# EAGLE design BLDC Controller (EAGLE 6.5.0)
AUTHOR: Douglas Hutchings; REVISION: A; YEAR: 2014

## Sheet 1 of 5
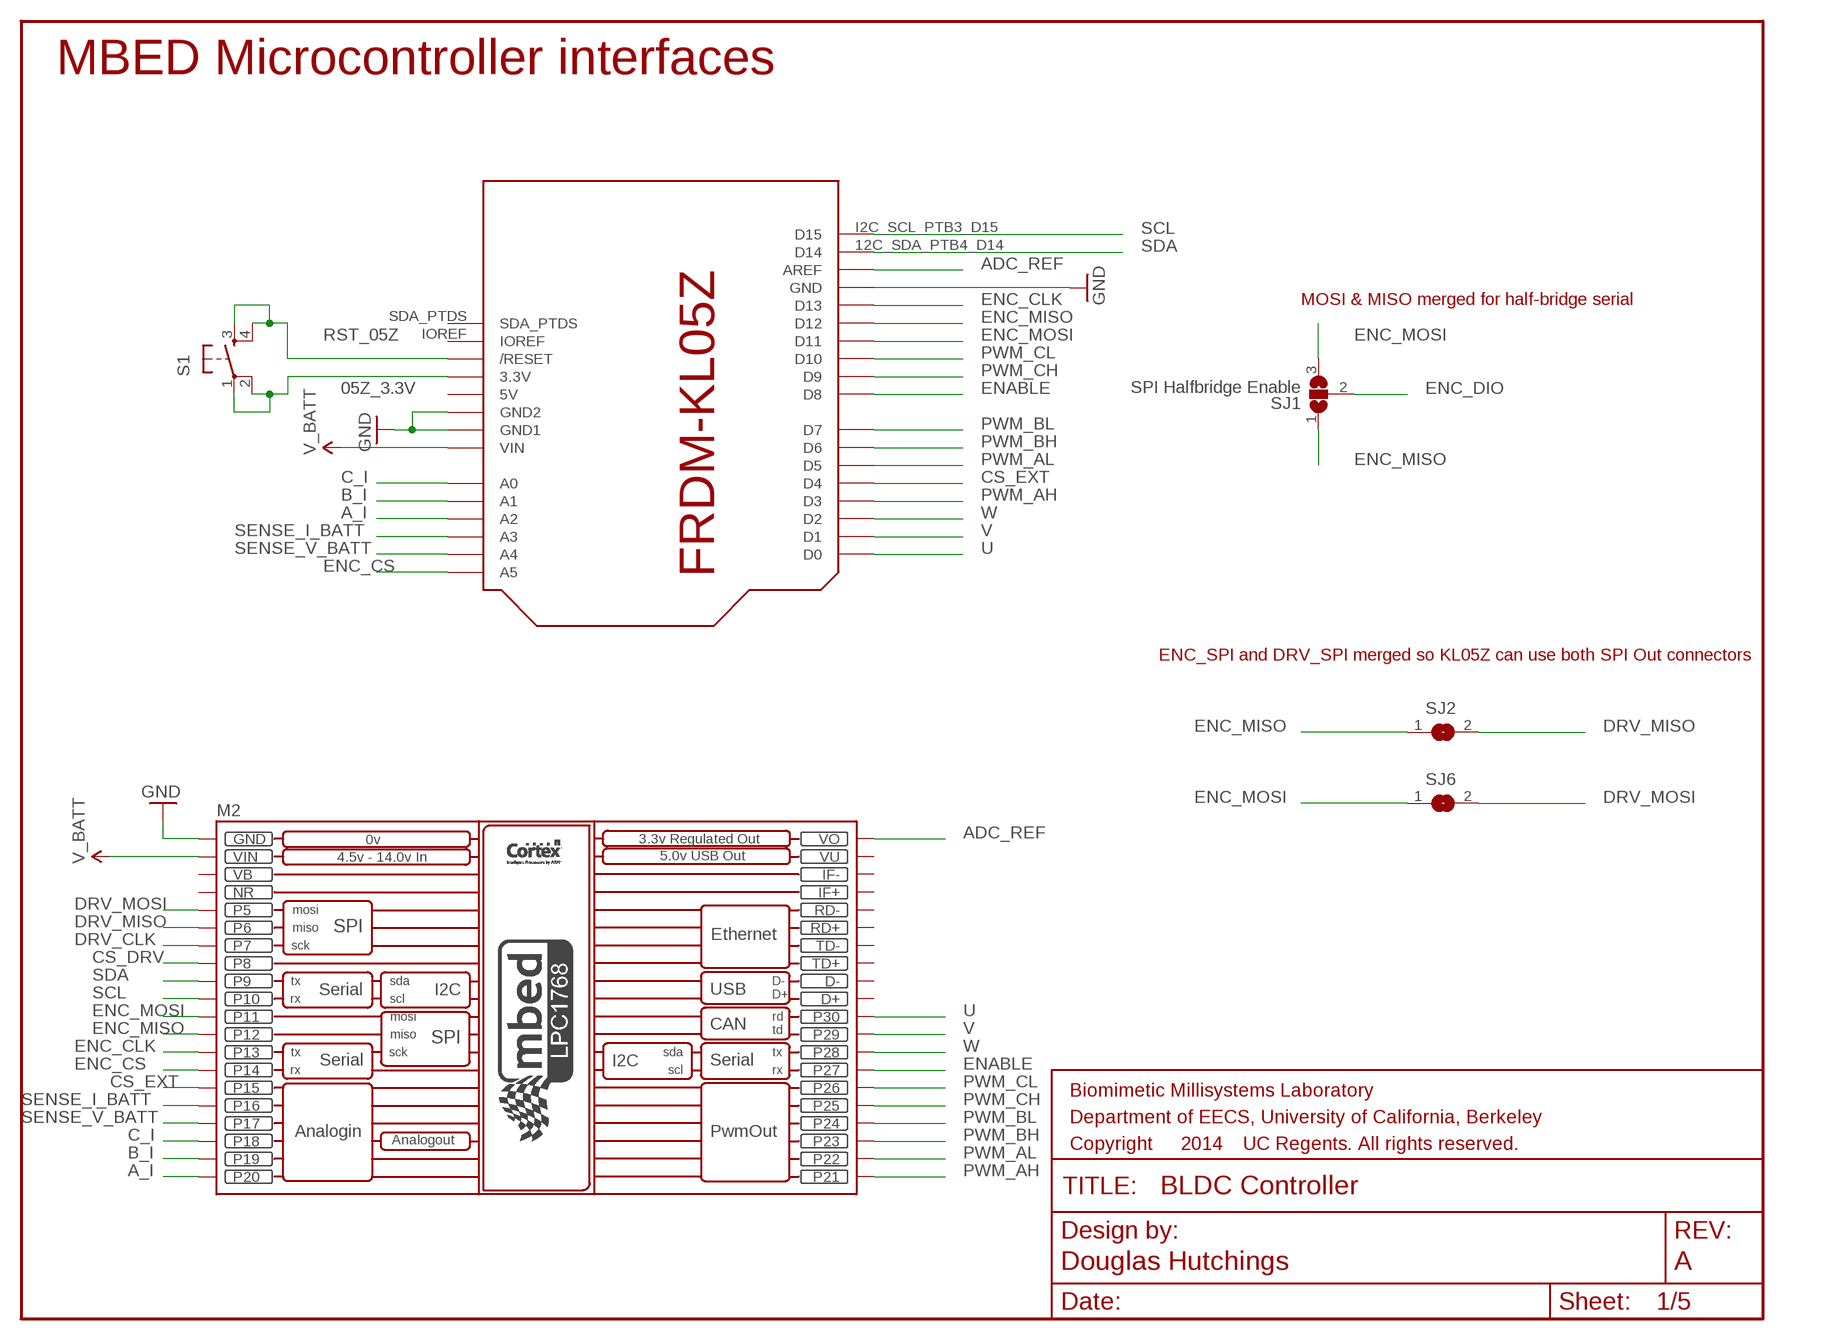
[diagram p0: schematic, sheet 1]

### Parts
M1  FRDM-KL05Z  [FREESCALEKL05Z]
M2  MBED_NXP_LPC1768  [MBED-KIT]
S1  TAC_SWITCHPTH  [TACTILE-PTH]
SJ1  SPI Halfbridge Enable  SJ2W  [SJ_2]
SJ2  SJ  [SJ]
SJ6  SJ  [SJ]

### Nets
05Z_3.3V: M1.3.3V S1.1 S1.2
A_I: M1.A2_PTA8(A2) M2.P$20(P20) ; also sheet 2
ADC_REF: M1.AVDD(AREF) M2.VOUT(VO) ; also sheet 2
B_I: M1.A1_PTB9(A1) M2.P$19(P19) ; also sheet 2
C_I: M1.A0_PTB8(A0) M2.P$18(P18) ; also sheet 2
CS_DRV: M2.P$8(P8) ; also sheet 2
CS_EXT: M1.PTA10_D4(D4) M2.P$15(P15) ; also sheet 4
DRV_CLK: M2.P$7(P7) ; also sheet 2
DRV_MISO: M2.P$6(P6) SJ2.2 ; also sheet 2,4
DRV_MOSI: M2.P$5(P5) SJ6.2 ; also sheet 2,4
ENABLE: M1.PTB10_D8(D8) M2.P$27(P27) ; also sheet 2
ENC_CLK: M1.SCK_PTB0_D13(D13) M2.P$13(P13) ; also sheet 5
ENC_CS: M1.A5_PTB13(A5) M2.P$14(P14) ; also sheet 4,5
ENC_DIO: SJ1.2 ; also sheet 5
ENC_MISO: M1.MISO_PTA6_D12(D12) M2.P$12(P12) SJ1.1 SJ2.1 ; also sheet 4
ENC_MOSI: M1.MOSI_PTA_D11(D11) M2.P$11(P11) SJ1.3 SJ6.1 ; also sheet 4
GND: M1.GND M1.GND1 M1.GND2 M2.GND ; also sheet 2,3,4,5
PWM_AH: M1.PTB5_D3(D3) M2.P$21(P21) ; also sheet 2
PWM_AL: M1.PTA12_D5(D5) M2.P$22(P22) ; also sheet 2
PWM_BH: M1.PTB6_D6(D6) M2.P$23(P23) ; also sheet 2
PWM_BL: M1.PTB7_D7(D7) M2.P$24(P24) ; also sheet 2
PWM_CH: M1.PTB11_D9(D9) M2.P$25(P25) ; also sheet 2
PWM_CL: M1.PTA_D10(D10) M2.P$26(P26) ; also sheet 2
RST_05Z: M1.RESET(/RESET) S1.3 S1.4
SCL: M1.I2C_SCL_PTB3_D15(D15) M2.P$10(P10) ; also sheet 4
SDA: M1.12C_SDA_PTB4_D14(D14) M2.P$9(P9) ; also sheet 4
SENSE_I_BATT: M1.A3_PTA0(A3) M2.P$16(P16) ; also sheet 3
SENSE_V_BATT: M1.A4_PTA9(A4) M2.P$17(P17) ; also sheet 3
U: M1.TX_PTB2_D0(D0) M2.P$30(P30) ; also sheet 4,5
V: M1.RX_PTB1_D1(D1) M2.P$29(P29) ; also sheet 4,5
V_BATT: M1.VIN M2.VIN ; also sheet 2,3,4,5
W: M1.PTA11_D2(D2) M2.P$28(P28) ; also sheet 4,5
Unconnected: M1.5V M1.IOREF M1.SDA_PTDS M2.D+ M2.D- M2.IF+ M2.IF- M2.RD+ M2.RD- M2.TD+ M2.TD- M2.VU

### Notes on the sheet
- MBED Microcontroller interfaces
- MOSI & MISO merged for half-bridge serial
- ENC_SPI and DRV_SPI merged so KL05Z can use both SPI Out connectors

## Sheet 2 of 5
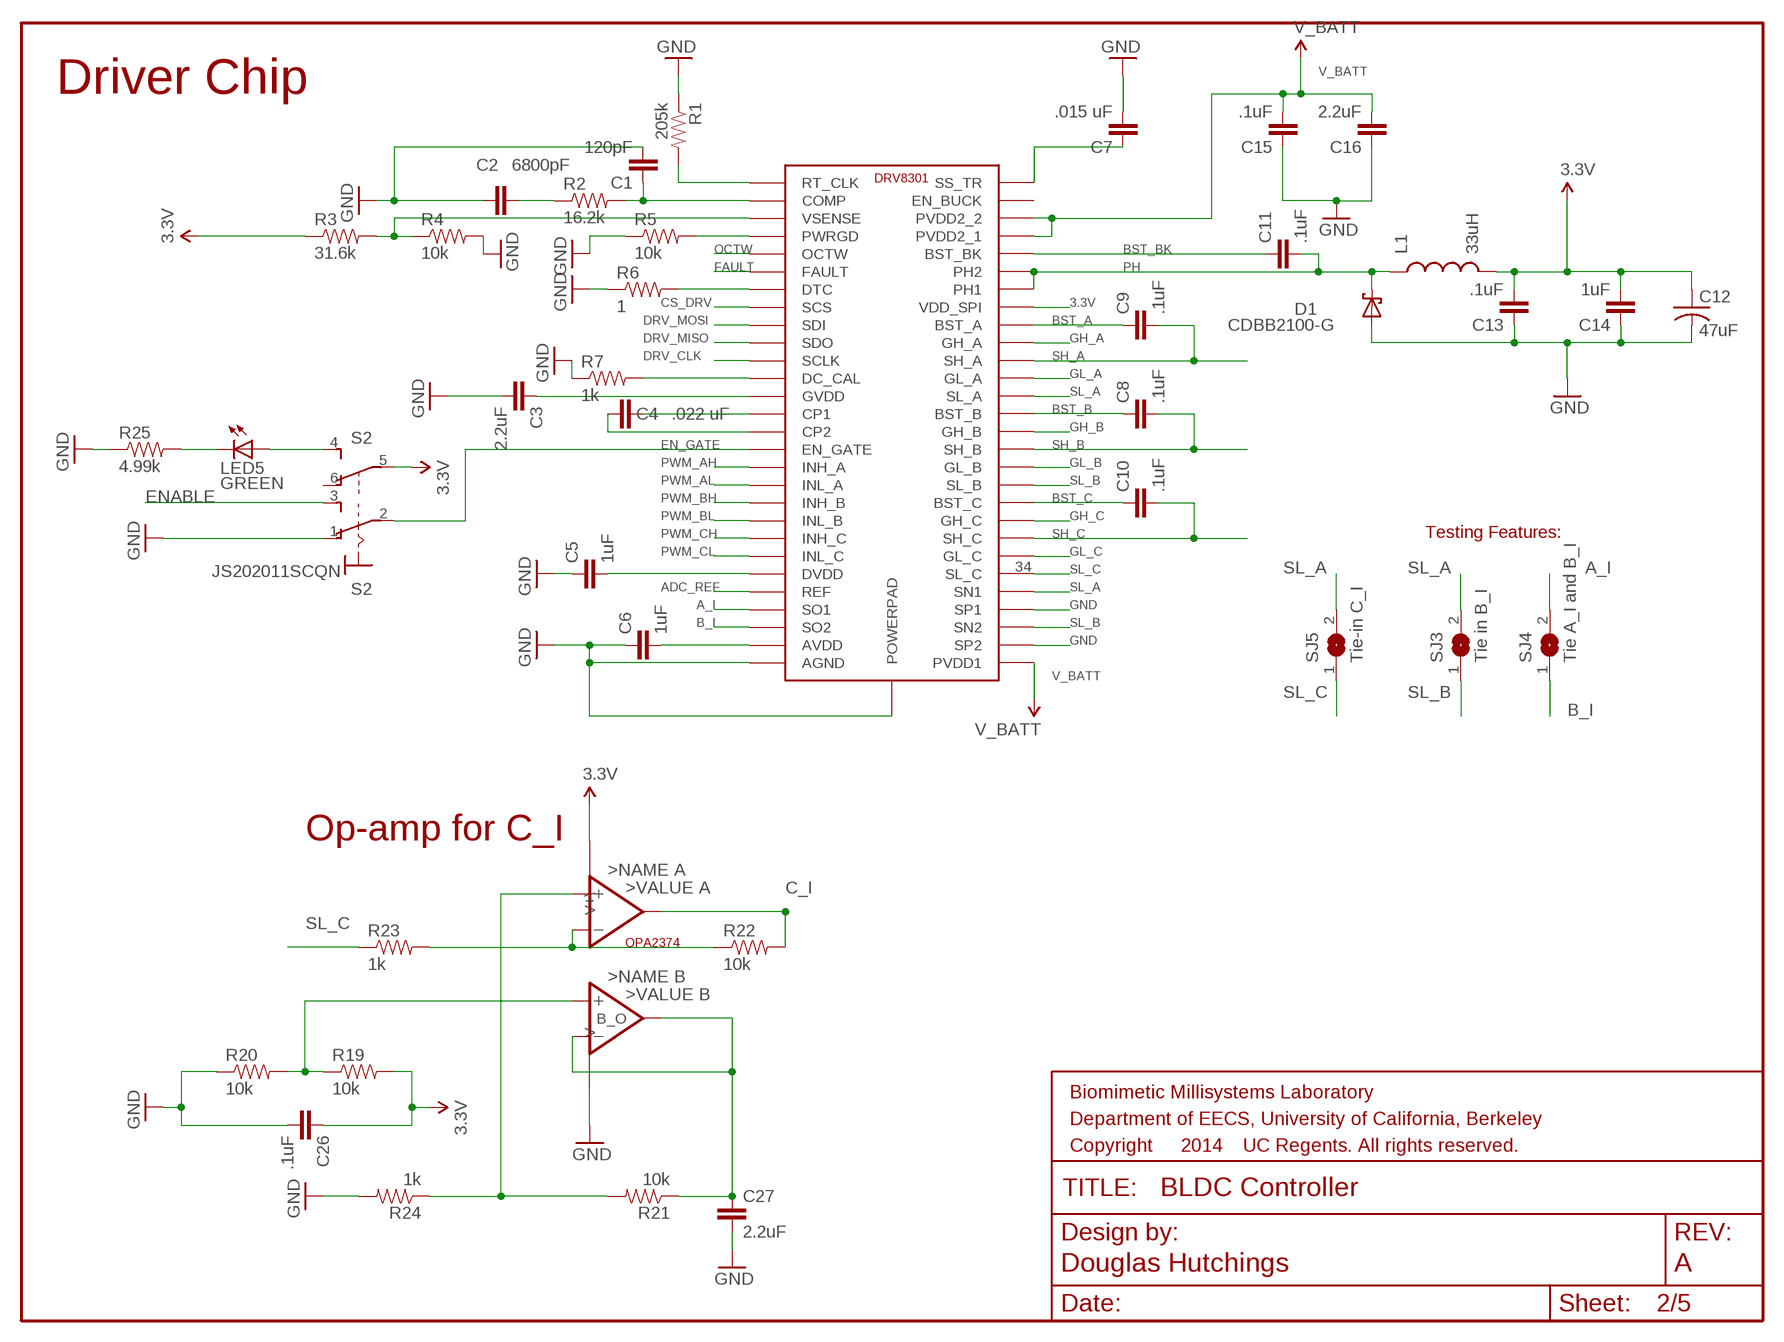
[diagram p1: schematic, sheet 2]

### Parts
C1  120pF  CAP0402-CAP  [0402-CAP]
C2  6800pF  CAP0402-CAP  [0402-CAP]
C3  2.2uF  CAP0402-CAP  [0402-CAP]
C4  .022 uF  CAP0402-CAP  [0402-CAP]
C5  1uF  CAP0402-CAP  [0402-CAP]
C6  1uF  CAP0402-CAP  [0402-CAP]
C7  .015 uF  CAP0402-CAP  [0402-CAP]
C8  .1uF  CAP0402-CAP  [0402-CAP]
C9  .1uF  CAP0402-CAP  [0402-CAP]
C10  .1uF  CAP0402-CAP  [0402-CAP]
C11  .1uF  CAP0402-CAP  [0402-CAP]
C12  47uF  C-USC0603  [C0603]
C13  .1uF  CAP0402-CAP  [0402-CAP]
C14  1uF  CAP0402-CAP  [0402-CAP]
C15  .1uF  CAP0402-CAP  [0402-CAP]
C16  2.2uF  CAP0402-CAP  [0402-CAP]
C26  .1uF  CAP0402-CAP  [0402-CAP]
C27  2.2uF  CAP0402-CAP  [0402-CAP]
D1  CDBB2100-G  SCHOTTKY-DIODESMD  [SMB]
IC1  DRV8301  [DRV8301]
IC2  OPA2374  [SOT-23]
L1  33uH  INDUCTOR0805  [0805]
LED5  GREEN  LED0603  [LED-0603]
R1  205k  RESISTOR0402-RES  [0402-RES]
R2  16.2k  RESISTOR0402-RES  [0402-RES]
R3  31.6k  RESISTOR0402-RES  [0402-RES]
R4  10k  RESISTOR0402-RES  [0402-RES]
R5  10k  RESISTOR0402-RES  [0402-RES]
R6  1  RESISTOR0402-RES  [0402-RES]
R7  1k  RESISTOR0402-RES  [0402-RES]
R19  10k  RESISTOR0402-RES  [0402-RES]
R20  10k  RESISTOR0402-RES  [0402-RES]
R21  10k  RESISTOR0402-RES  [0402-RES]
R22  10k  RESISTOR0402-RES  [0402-RES]
R23  1k  RESISTOR0402-RES  [0402-RES]
R24  1k  RESISTOR0402-RES  [0402-RES]
R25  4.99k  RESISTOR0603-RES  [0603-RES]
S2  JS202011SCQN  [JS202011SCQN]
SJ3  Tie in B_I  SJ  [SJ]
SJ4  Tie A_I and B_I  SJ  [SJ]
SJ5  Tie-in C_I  SJ  [SJ]

### Nets
3.3V: C12.1 C13.2 C14.2 C26.1 IC1.49(VDD_SPI) IC2.5(V+\) L1.2 R3.1 R19.2 S2.5(P) ; also sheet 4,5
3.3V1: LED5.A S2.4(S)
A_I: IC1.25(SO1) SJ4.2 ; also sheet 1
ADC_REF: IC1.24(REF) ; also sheet 1
AVDD: C6.2 IC1.27(AVDD)
B_I: IC1.26(SO2) SJ4.1 ; also sheet 1
BST_A: C9.1 IC1.48(BST_A)
BST_B: C8.1 IC1.43(BST_B)
BST_BK: C11.1 IC1.52(BST_BK)
BST_C: C10.1 IC1.38(BST_C)
C_I: IC2.1(A_O) R22.2 ; also sheet 1
CP1: C4.2 IC1.14(CP1)
CP2: C4.1 IC1.15(CP2)
CS_DRV: IC1.8(SCS) ; also sheet 1
DC_CAL: IC1.12(DC_CAL) R7.2
DRV_CLK: IC1.11(SCLK) ; also sheet 1
DRV_MISO: IC1.10(SDO) ; also sheet 1,4
DRV_MOSI: IC1.9(SDI) ; also sheet 1,4
DTC: IC1.7(DTC) R6.2
DVDD: C5.2 IC1.23(DVDD)
EN_GATE: IC1.16(EN_GATE) S2.2(P)
ENABLE: S2.3(S) ; also sheet 1
FAULT: IC1.6(FAULT) ; also sheet 4
GH_A: IC1.47(GH_A) ; also sheet 3
GH_B: IC1.42(GH_B) ; also sheet 3
GH_C: IC1.37(GH_C) ; also sheet 3
GL_A: IC1.45(GL_A) ; also sheet 3
GL_B: IC1.40(GL_B) ; also sheet 3
GL_C: IC1.35(GL_C) ; also sheet 3
GND: C1.2 C2.2 C3.2 C5.1 C6.1 C7.2 C12.2 C13.1 C14.1 C15.1 C16.1 C26.2 C27.2 D1.A IC1.28(AGND) IC1.30(SP2) IC1.32(SP1) IC1.EXP@1(POWERPAD) IC1.EXP@2(POWERPAD) IC2.4(V-) R1.1 R4.2 R5.1 R6.1 R7.1 R20.1 R24.2 R25.1 S2.1(O) ; also sheet 1,3,4,5
GVDD: C3.1 IC1.13(GVDD)
N$1: C1.1 IC1.2(COMP) R2.2
N$2: C2.1 R2.1
N$12: IC2.8(B+) R19.1 R20.2
N$14: C27.1 IC2.6(B_O) IC2.7(B-) R21.1
N$15: IC2.3(A+) R21.2 R24.1
N$16: IC2.2(A-) R22.1 R23.2
N$19: LED5.C R25.2
OCTW: IC1.5(OCTW) ; also sheet 4
PH: C11.2 D1.C IC1.50(PH1) IC1.51(PH2) L1.1
PWM_AH: IC1.17(INH_A) ; also sheet 1
PWM_AL: IC1.18(INL_A) ; also sheet 1
PWM_BH: IC1.19(INH_B) ; also sheet 1
PWM_BL: IC1.20(INL_B) ; also sheet 1
PWM_CH: IC1.21(INH_C) ; also sheet 1
PWM_CL: IC1.22(INL_C) ; also sheet 1
PWRGD: IC1.4(PWRGD) R5.2
RT_CLK: IC1.1(RT_CLK) R1.2
SH_A: C9.2 IC1.46(SH_A) ; also sheet 3
SH_B: C8.2 IC1.41(SH_B) ; also sheet 3
SH_C: C10.2 IC1.36(SH_C) ; also sheet 3
SL_A: IC1.33(SN1) IC1.44(SL_A) SJ3.2 SJ5.2 ; also sheet 3
SL_B: IC1.31(SN2) IC1.39(SL_B) SJ3.1 ; also sheet 3
SL_C: IC1.34(SL_C) R23.1 SJ5.1 ; also sheet 3
SS_TR: C7.1 IC1.56(SS_TR)
V_BATT: C15.2 C16.2 IC1.29(PVDD1) IC1.53(PVDD2_1) IC1.54(PVDD2_2) ; also sheet 1,3,4,5
VSENSE: IC1.3(VSENSE) R3.2 R4.1
Unconnected: IC1.55(EN_BUCK) S2.6(O)

### Notes on the sheet
- Driver Chip
- Testing Features:
- Op-amp for C_I

## Sheet 3 of 5
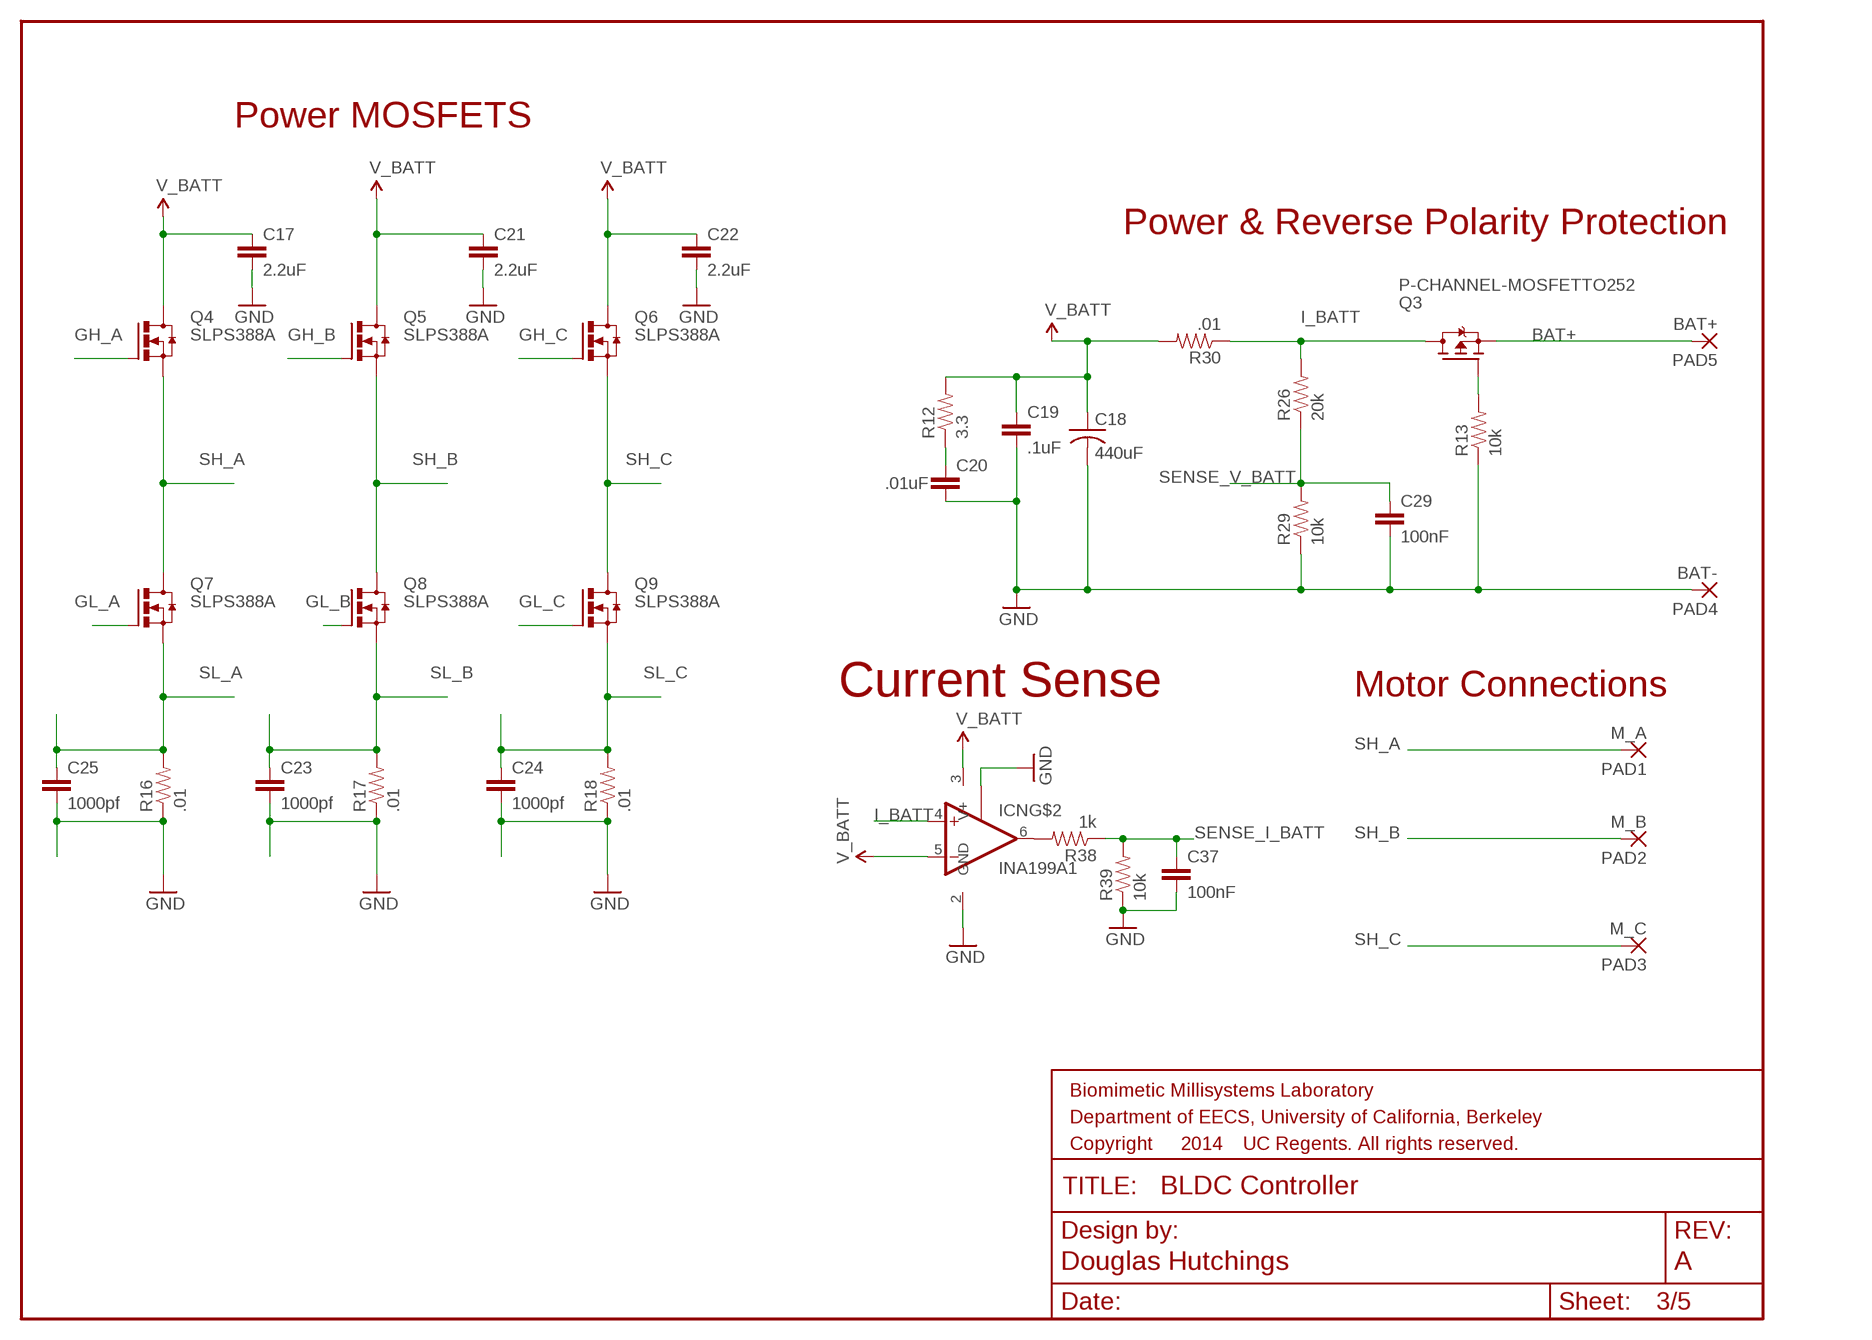
[diagram p2: schematic, sheet 3]

### Parts
C17  2.2uF  CAP0603-CAP  [0603-CAP]
C18  440uF  C-USC1210  [C1210]
C19  .1uF  CAP0402-CAP  [0402-CAP]
C20  .01uF  CAP0402-CAP  [0402-CAP]
C21  2.2uF  CAP0603-CAP  [0603-CAP]
C22  2.2uF  CAP0603-CAP  [0603-CAP]
C23  1000pf  CAP0603-CAP  [0603-CAP]
C24  1000pf  CAP0603-CAP  [0603-CAP]
C25  1000pf  CAP0603-CAP  [0603-CAP]
C29  100nF  CAP0402-CAP  [0402-CAP]
C37  100nF  CAP0402-CAP  [0402-CAP]
ICN  INA199A1  [SC70-6]
PAD1  M_A  SMD2  [SMD1,27-2,54]
PAD2  M_B  SMD2  [SMD1,27-2,54]
PAD3  M_C  SMD2  [SMD1,27-2,54]
PAD4  BAT-  SMD2  [SMD1,27-2,54]
PAD5  BAT+  SMD2  [SMD1,27-2,54]
Q3  P-CHANNEL-MOSFETTO252  [TO252]
Q4  SLPS388A  [SLPS388A]
Q5  SLPS388A  [SLPS388A]
Q6  SLPS388A  [SLPS388A]
Q7  SLPS388A  [SLPS388A]
Q8  SLPS388A  [SLPS388A]
Q9  SLPS388A  [SLPS388A]
R12  3.3  RESISTOR0402-RES  [0402-RES]
R13  10k  RESISTOR0603-RES  [0603-RES]
R16  .01  RESISTOR2010  [R2010]
R17  .01  RESISTOR2010  [R2010]
R18  .01  RESISTOR2010  [R2010]
R26  20k  RESISTOR0402-RES  [0402-RES]
R29  10k  RESISTOR0402-RES  [0402-RES]
R30  .01  RESISTOR2010  [R2010]
R38  1k  RESISTOR0402-RES  [0402-RES]
R39  10k  RESISTOR0402-RES  [0402-RES]

### Nets
BAT+: PAD5.1(P) Q3.2(S)
GH_A: Q4.4(G) ; also sheet 2
GH_B: Q5.4(G) ; also sheet 2
GH_C: Q6.4(G) ; also sheet 2
GL_A: Q7.4(G) ; also sheet 2
GL_B: Q8.4(G) ; also sheet 2
GL_C: Q9.4(G) ; also sheet 2
GND: C17.2 C18.2 C19.2 C20.2 C21.2 C22.2 C23.2 C24.2 C25.2 C29.2 C37.2 ICN.1(REF) ICN.2(GND) PAD4.1(P) R13.1 R16.1 R17.1 R18.1 R29.1 R39.1 ; also sheet 1,2,4,5
I_BATT: ICN.4(+IN) Q3.3(D) R26.2 R30.1
N$7: C20.1 R12.1
N$9: Q3.1(G) R13.2
N$18: ICN.6(OUT) R38.2
SENSE_I_BATT: C37.1 R38.1 R39.2 ; also sheet 1
SENSE_V_BATT: C29.1 R26.1 R29.2 ; also sheet 1
SH_A: PAD1.1(P) Q4.1(S) Q4.2(S) Q4.3(S) Q7.5(D) Q7.6(D) Q7.7(D) Q7.8(D) Q7.PAD(D) ; also sheet 2
SH_B: PAD2.1(P) Q5.1(S) Q5.2(S) Q5.3(S) Q8.5(D) Q8.6(D) Q8.7(D) Q8.8(D) Q8.PAD(D) ; also sheet 2
SH_C: PAD3.1(P) Q6.1(S) Q6.2(S) Q6.3(S) Q9.5(D) Q9.6(D) Q9.7(D) Q9.8(D) Q9.PAD(D) ; also sheet 2
SL_A: C25.1 Q7.1(S) Q7.2(S) Q7.3(S) R16.2 ; also sheet 2
SL_B: C23.1 Q8.1(S) Q8.2(S) Q8.3(S) R17.2 ; also sheet 2
SL_C: C24.1 Q9.1(S) Q9.2(S) Q9.3(S) R18.2 ; also sheet 2
V_BATT: C17.1 C18.1 C19.1 C21.1 C22.1 ICN.3(V+) ICN.5(-IN) Q4.5(D) Q4.6(D) Q4.7(D) Q4.8(D) Q4.PAD(D) Q5.5(D) Q5.6(D) Q5.7(D) Q5.8(D) Q5.PAD(D) Q6.5(D) Q6.6(D) Q6.7(D) Q6.8(D) Q6.PAD(D) R12.2 R30.2 ; also sheet 1,2,4,5

### Notes on the sheet
- Power MOSFETS
- Power & Reverse Polarity Protection
- Current Sense | Motor Connections

## Sheet 4 of 5
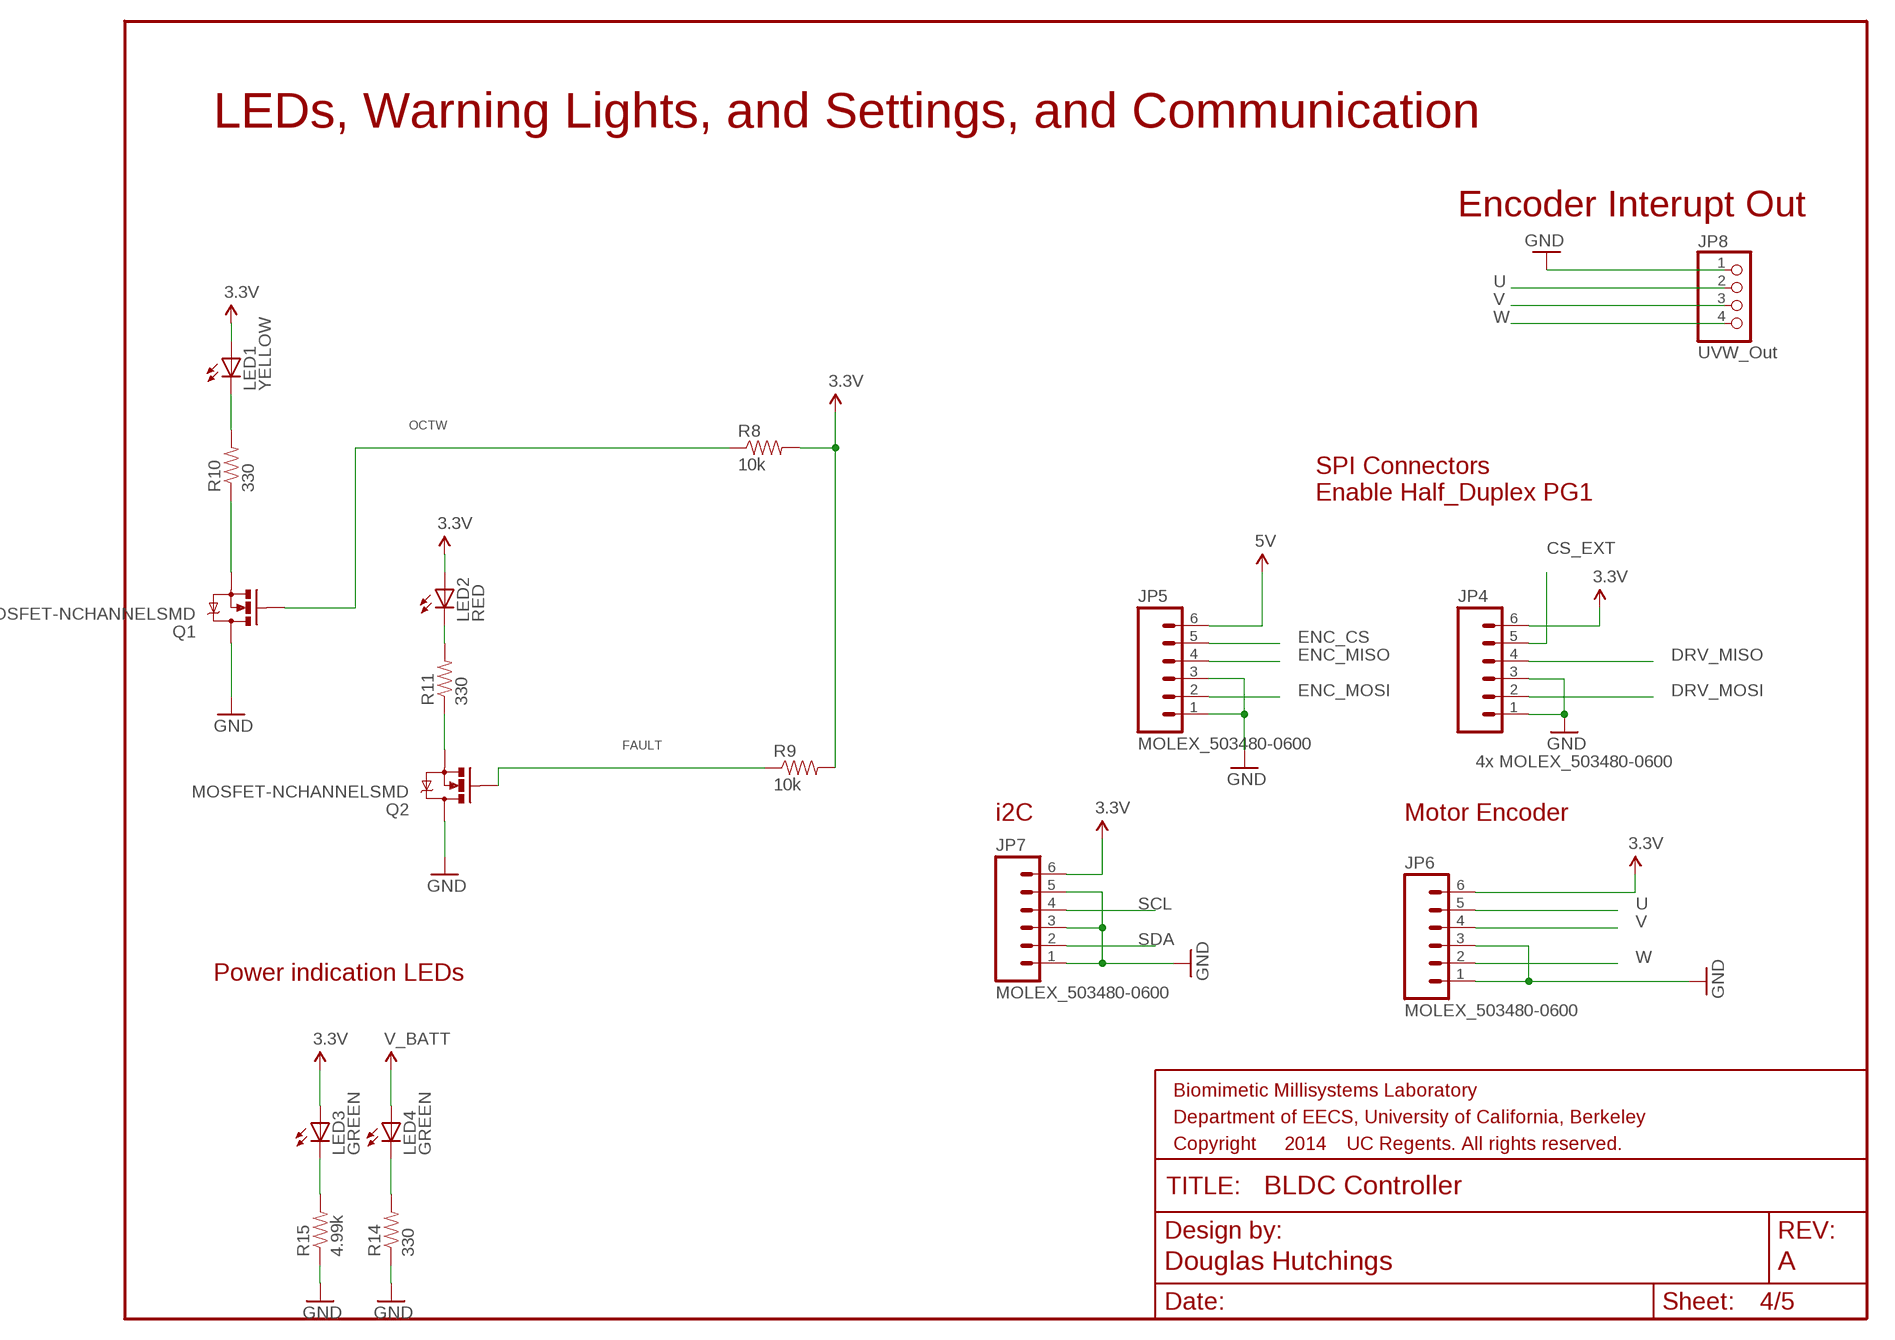
[diagram p3: schematic, sheet 4]

### Parts
JP4  4x MOLEX_503480-0600  MOLEX_503480-0600  [MOLEX_503480-0600]
JP5  MOLEX_503480-0600  [MOLEX_503480-0600]
JP6  MOLEX_503480-0600  [MOLEX_503480-0600]
JP7  MOLEX_503480-0600  [MOLEX_503480-0600]
JP8  UVW_Out  PINHD-1X4  [1X04]
LED1  YELLOW  LED0603  [LED-0603]
LED2  RED  LED0603  [LED-0603]
LED3  GREEN  LED0603  [LED-0603]
LED4  GREEN  LED0603  [LED-0603]
Q1  MOSFET-NCHANNELSMD  [SOT23-3]
Q2  MOSFET-NCHANNELSMD  [SOT23-3]
R8  10k  RESISTOR0402-RES  [0402-RES]
R9  10k  RESISTOR0402-RES  [0402-RES]
R10  330  RESISTOR0603-RES  [0603-RES]
R11  330  RESISTOR0603-RES  [0603-RES]
R14  330  RESISTOR0603-RES  [0603-RES]
R15  4.99k  RESISTOR0603-RES  [0603-RES]

### Nets
3.3V: JP4.6 JP6.6 JP7.6 LED1.A LED2.A LED3.A R8.2 R9.2 ; also sheet 2,5
5V: JP5.6 ; also sheet 5
CS_EXT: JP4.5 ; also sheet 1
DRV_MISO: JP4.4 ; also sheet 1,2
DRV_MOSI: JP4.2 ; also sheet 1,2
ENC_CS: JP5.5 ; also sheet 1,5
ENC_MISO: JP5.4 ; also sheet 1
ENC_MOSI: JP5.2 ; also sheet 1
FAULT: Q2.1(G) R9.1 ; also sheet 2
GND: JP4.1 JP4.3 JP5.1 JP5.3 JP6.1 JP6.3 JP7.1 JP7.3 JP7.5 JP8.1 Q1.3(D) Q2.3(D) R14.1 R15.1 ; also sheet 1,2,3,5
N$3: LED1.C R10.2
N$4: LED2.C R11.2
N$5: Q1.2(S) R10.1
N$6: Q2.2(S) R11.1
N$8: LED3.C R15.2
N$10: LED4.C R14.2
OCTW: Q1.1(G) R8.1 ; also sheet 2
SCL: JP7.4 ; also sheet 1
SDA: JP7.2 ; also sheet 1
U: JP6.5 JP8.2 ; also sheet 1,5
V: JP6.4 JP8.3 ; also sheet 1,5
V_BATT: LED4.A ; also sheet 1,2,3,5
W: JP6.2 JP8.4 ; also sheet 1,5

### Notes on the sheet
- LEDs, Warning Lights, and Settings, and Communication
- Encoder Interupt Out
- SPI Connectors
  Enable Half_Duplex PG1
- i2C | Motor Encoder
- Power indication LEDs

## Sheet 5 of 5
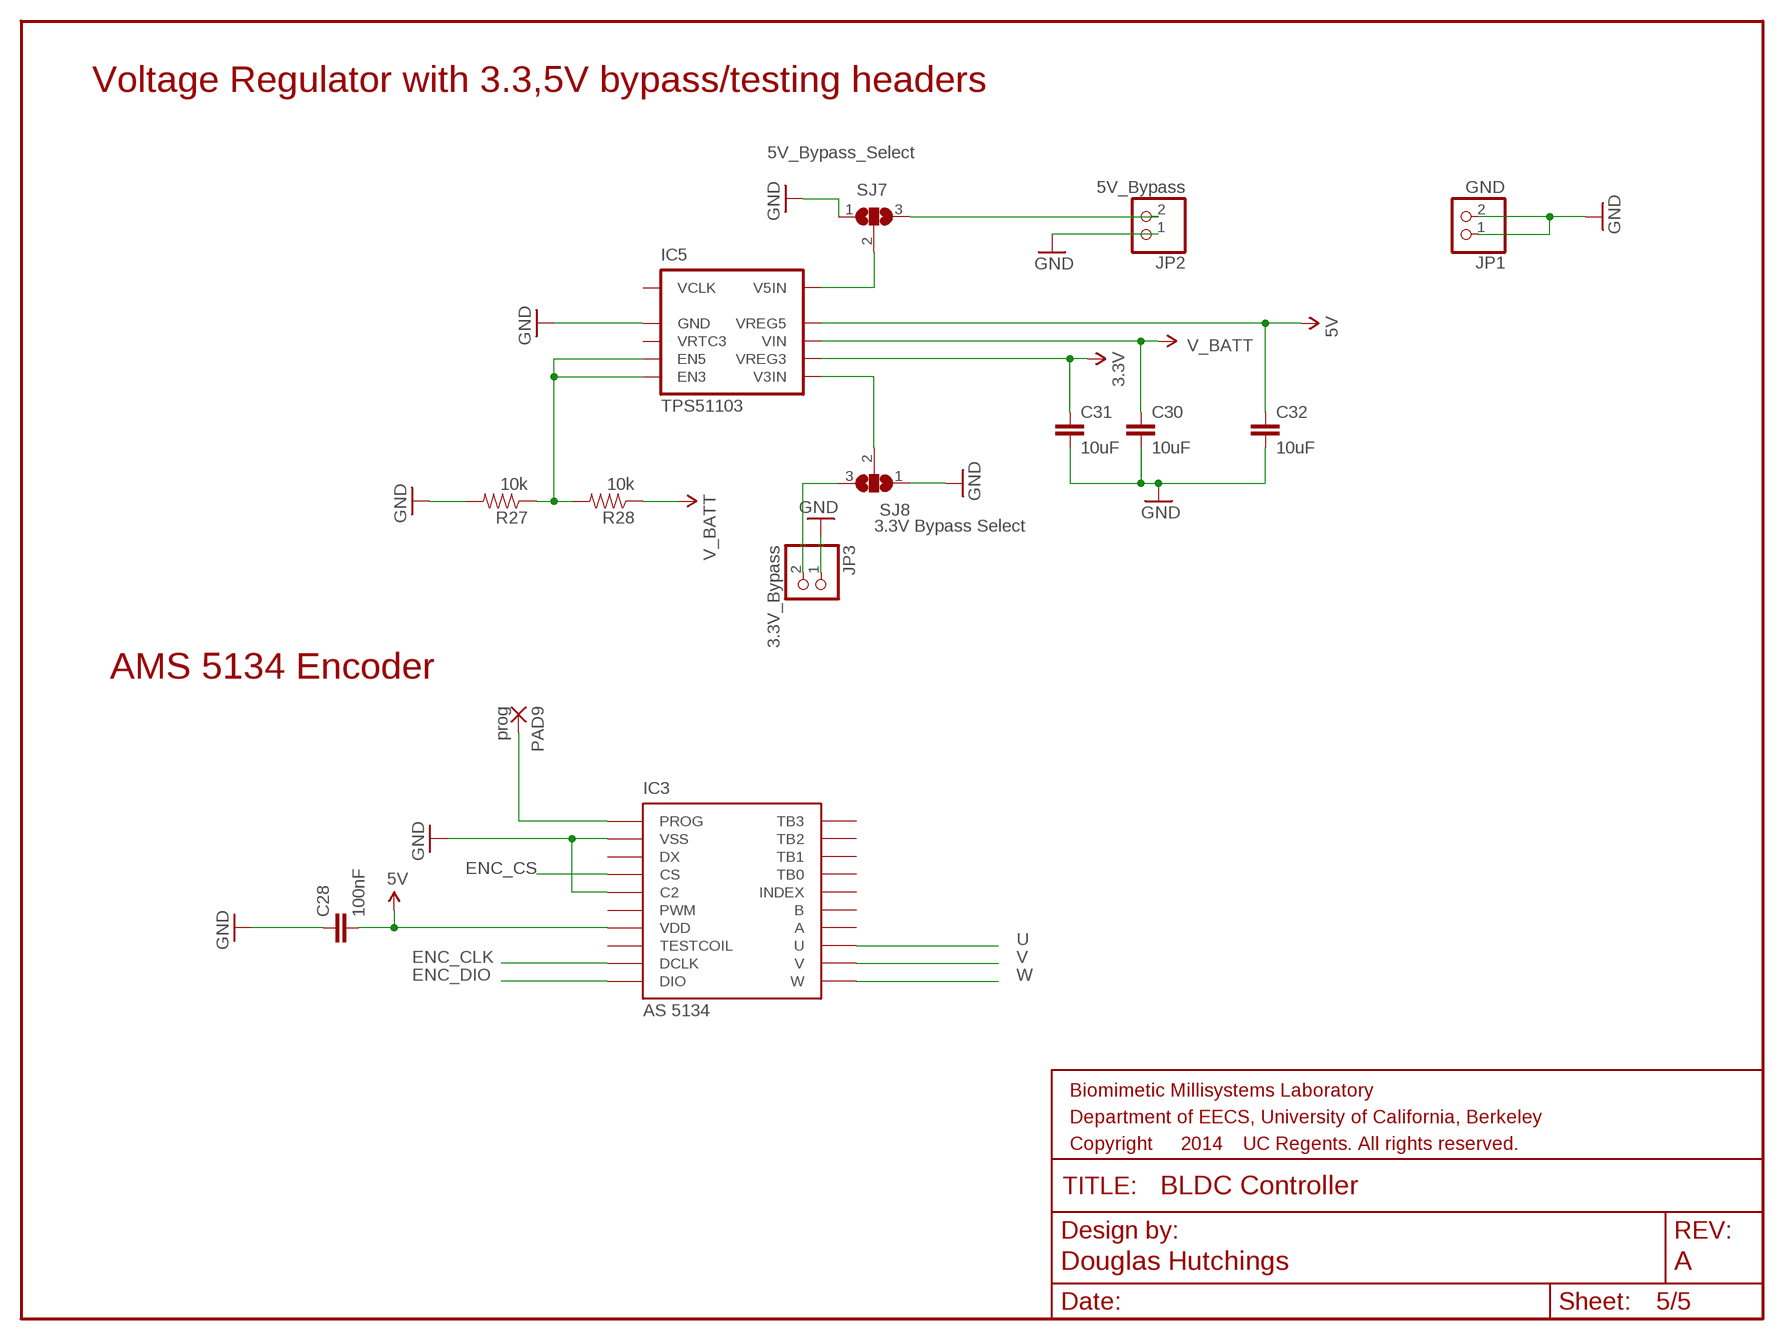
[diagram p4: schematic, sheet 5]

### Parts
C28  100nF  CAP0402-CAP  [0402-CAP]
C30  10uF  CAP0603-CAP  [0603-CAP]
C31  10uF  CAP0603-CAP  [0603-CAP]
C32  10uF  CAP0603-CAP  [0603-CAP]
IC3  AS 5134  AS5134  [AS5134]
IC5  TPS51103  [DRC(S-PVSON-N10)]
JP1  GND  PINHD-1X2  [1X02]
JP2  5V_Bypass  PINHD-1X2  [1X02]
JP3  3.3V_Bypass  PINHD-1X2  [1X02]
PAD9  prog  SMD2  [SMD1,27-2,54]
R27  10k  RESISTOR0402-RES  [0402-RES]
R28  10k  RESISTOR0402-RES  [0402-RES]
SJ7  5V_Bypass_Select  SJ2W  [SJ_2]
SJ8  3.3V Bypass Select  SJ2W  [SJ_2]

### Nets
3.3V: C31.1 IC5.7(VREG3) ; also sheet 2,4
5V: C28.2 C32.1 IC3.7(VDD) IC5.9(VREG5) ; also sheet 4
ENC_CLK: IC3.9(DCLK) ; also sheet 1
ENC_CS: IC3.4(CS) ; also sheet 1,4
ENC_DIO: IC3.10(DIO) ; also sheet 1
GND: C28.1 C30.2 C31.2 C32.2 IC3.2(VSS) IC3.5(C2) IC5.2(GND) IC5.TH(GND) JP1.1 JP1.2 JP2.1 JP3.1 R27.2 SJ7.1 SJ8.1 ; also sheet 1,2,3,4
N$11: JP2.2 SJ7.3
N$13: JP3.2 SJ8.3
N$17: IC3.1(PROG) PAD9.1(P)
PWR_ENABLE1: IC5.4(EN5) IC5.5(EN3) R27.1 R28.2
U: IC3.11(U) ; also sheet 1,4
V: IC3.12(V) ; also sheet 1,4
V3IN1: IC5.6(V3IN) SJ8.2
V5IN1: IC5.10(V5IN) SJ7.2
V_BATT: C30.1 IC5.8(VIN) R28.1 ; also sheet 1,2,3,4
W: IC3.13(W) ; also sheet 1,4
Unconnected: IC3.3(DX) IC3.6(PWM) IC3.8(TESTCOIL) IC3.14(A) IC3.15(B) IC3.16(INDEX) IC3.17(TB0) IC3.18(TB1) IC3.19(TB2) IC3.20(TB3) IC5.1(VCLK) IC5.3(VRTC3)

### Notes on the sheet
- Voltage Regulator with 3.3,5V bypass/testing headers
- AMS 5134 Encoder

## Power pins joined to a net without a drawn wire
NR: M2.NR
VB: M2.VB

## Library data of the parts
C1-C11 C13-C17 C19-C32 C37 = biomimetic:CAP: Capacitor Standard 0603 ceramic capacitor, and 0.1" leaded capacitor.
C12 C18 = adafruit:C-US: CAPACITOR, American symbol
D1 = diode:SCHOTTKY-DIODE: Schottky Diode
IC1 = biomimetic:DRV8301: DRV8301, a BLDC controller
IC2 = biomimetic:OPA2374: OPA2374, A SMT Dual op amp
IC3 = biomimetic:AS5134: AS5134 A rotary magnetic encoder primarily used for serial comms and BLDC control
IC5 = biomimetic:TPS51103: TPS 51103 - 5,3.3V regulator
ICN = modular_robotics:INA199A1
JP1-JP3 = pinhead:PINHD-1X2: PIN HEADER
JP4-JP7 = biomimetic:MOLEX_503480-0600
JP8 = pinhead:PINHD-1X4: PIN HEADER
L1 = biomimetic:INDUCTOR: Inductors Basic Inductor/Choke - 0603 and 1206. Footprints are not proven and vary greatly between part numbers.
LED1-LED5 = biomimetic:LED: LEDs Standard schematic elements and footprints for 5mm, 3mm, 1206, and 0603 sized LEDs. 5mm - Spark Fun Electronics SKU : COM-00529 (and others)
M1 = biomimetic:FRDM-KL05Z: Freescale FRDM-KL05Z
M2 = zumy:MBED_NXP_LPC1768: Mbed LPC1768 - ARM CORTEX v2.1 * Schematic symbol is now placed in eagles's default raster. *The pads diameter are suitable for routing between mbed pins * mbed pads are 0.8 mm drill diameter. --------------------------------------------- Created by: Mohamed Yousry *Alexandria, Egypt *Email: mohamed.yousry@ieeegoldegypt.org
PAD1-PAD5 PAD9 = wirepad:SMD2: SMD PAD
Q1 Q2 = pie:MOSFET-NCHANNEL: N-Type MOSFET, SOT23-3 Package
Q3 = pie:P-CHANNEL-MOSFET: P-Channel PowerTrench® MOSFET Source: FDD4141.pdf; PIE-DIGIKEY-PN-PRI: IPD90P03P4L-04INCT-ND
Q4-Q9 = biomimetic:SLPS388A: SLPS388A power mosfet
R1-R30 R38 R39 = biomimetic:RESISTOR: Resistor Basic schematic elements and footprints for 0603, 1206, and PTH resistors.
S1 = pie:TAC_SWITCH: Momentary Switch Button commonly used for reset or general input. Spark Fun Electronics SKU : COM-00097; PIE-INT-REF-NUM: pth_pushbutton
S2 = modular_robotics:JS202011SCQN
SJ1 SJ7 SJ8 = jumper:SJ2W: SMD solder JUMPER
SJ2-SJ6 = jumper:SJ: SMD solder JUMPER

## Board
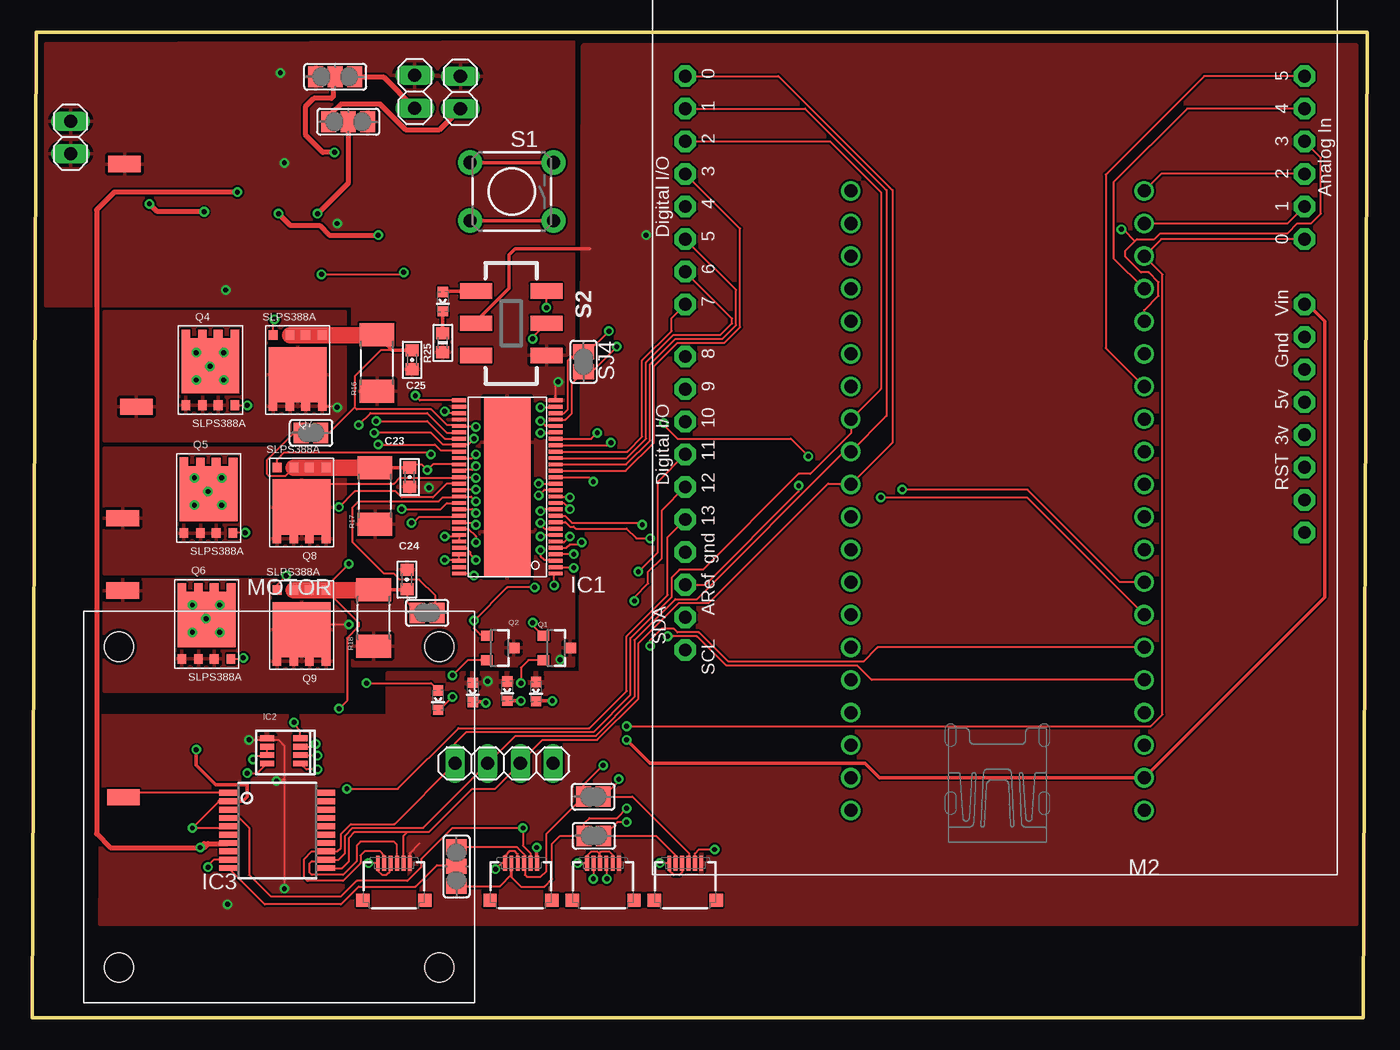
[diagram p5: board, top side]
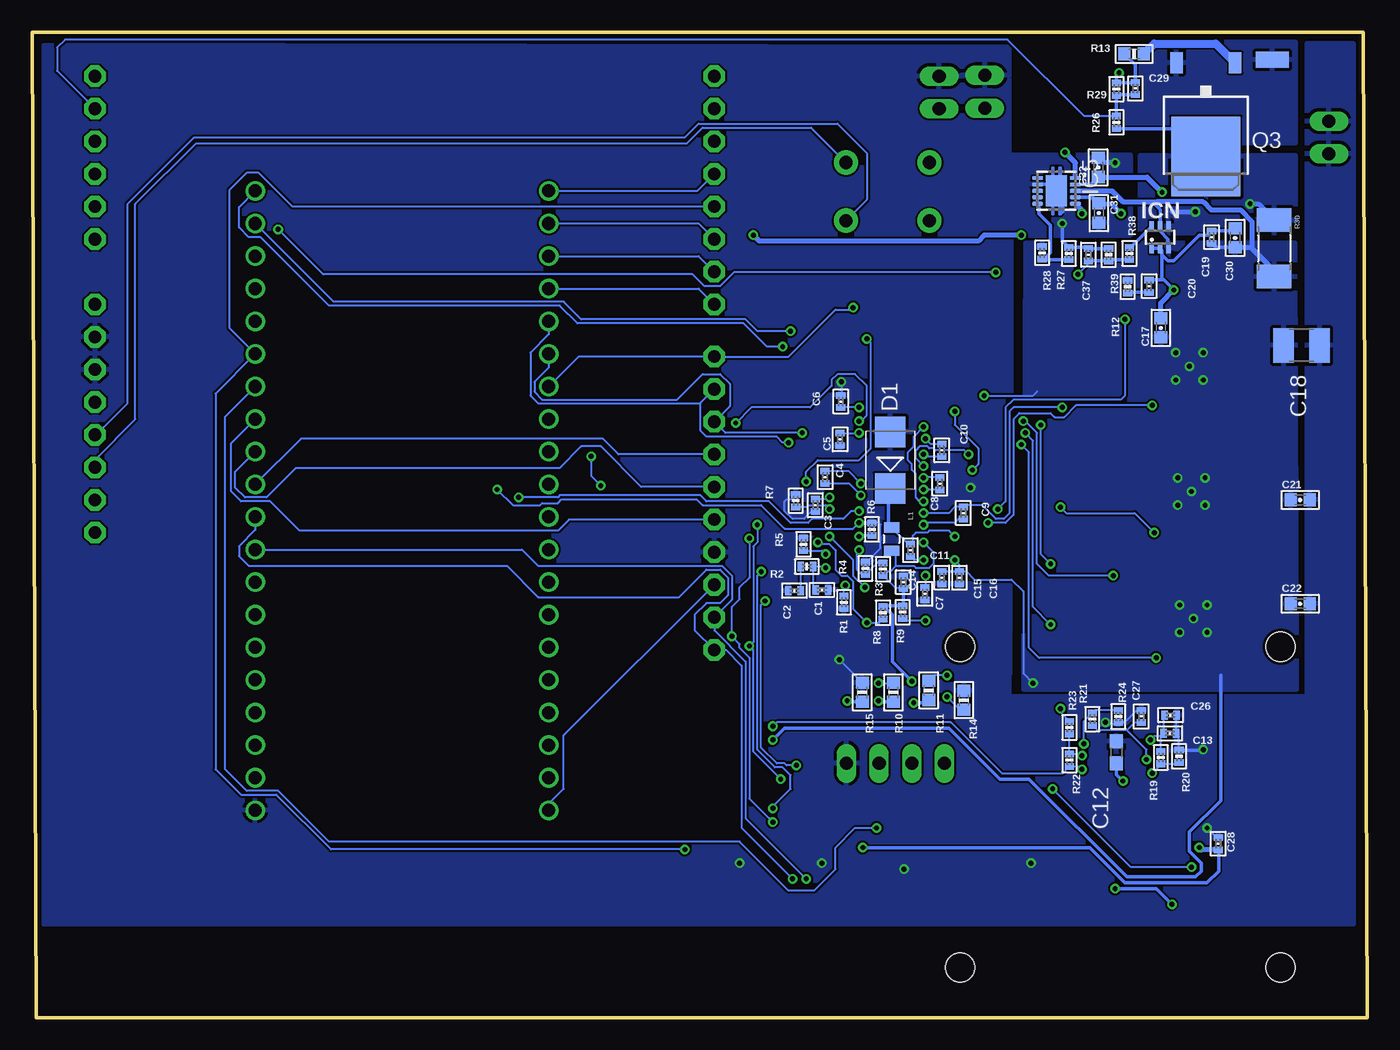
[diagram p6: board, bottom side, seen from below]

Size 104.06 x 76.78 mm. Coordinates in mm from the lower left corner, seen from the top.
Outline: 0,0 103.76,0 104.06,76.78 0.3,76.78 0,0
Copper layers (1*16): Top 2mil / dielectric 27mil / Bottom 2mil
Design rules "advancedcircuits-standard-biomimetic *": minimum track width 5mil, minimum drill 10mil, track to track 6mil, track to pad 6mil, pad to pad 6mil, via to via 6mil, smd to smd 6mil, copper to edge 0.256540625mm, drill to drill 0.256540625mm, minimum pad ring 0.180340625mm, minimum via ring 0.180340625mm, stop-mask expansion 2mil, vias tented up to drill 0mil, thermal gap 10mil

### Footprints (pad centres in the part's own frame; a part is rotated, then mirrored left to right if it is on the bottom)
0402-CAP = smd 0.508 x 0.711: 1 -0.483,0; 2 0.483,0
C0603 = smd 1.1 x 1: 1 -0.85,0; 2 0.85,0
0603-CAP = smd 0.94 x 1.016: 1 -0.749,0; 2 0.749,0
C1210 = smd 1.6 x 2.7: 1 -1.4,0; 2 1.4,0
SMB = smd 2.4 x 2.4: A 2.2,0; C -2.2,0
DRV8301 = smd 0.3 x 1.1: 1 -6.75,-3.75; 2 -6.25,-3.75; 3 -5.75,-3.75; 4 -5.25,-3.75; 5 -4.75,-3.75; 6 -4.25,-3.75; 7 -3.75,-3.75; 8 -3.25,-3.75; 9 -2.75,-3.75; 10 -2.25,-3.75; 11 -1.75,-3.75; 12 -1.25,-3.75; 13 -0.75,-3.75; 14 -0.25,-3.75; 15 0.25,-3.75; 16 0.75,-3.75; 17 1.25,-3.75; 18 1.75,-3.75; 19 2.25,-3.75; 20 2.75,-3.75; 21 3.25,-3.75; 22 3.75,-3.75; 23 4.25,-3.75; 24 4.75,-3.75; 25 5.25,-3.75; 26 5.75,-3.75; 27 6.25,-3.75; 28 6.75,-3.75; 29 6.75,3.75; 30 6.25,3.75; 31 5.75,3.75; 32 5.25,3.75; 33 4.75,3.75; 34 4.25,3.75; 35 3.75,3.75; 36 3.25,3.75; 37 2.75,3.75; 38 2.25,3.75; 39 1.75,3.75; 40 1.25,3.75; 41 0.75,3.75; 42 0.25,3.75; 43 -0.25,3.75; 44 -0.75,3.75; 45 -1.25,3.75; 46 -1.75,3.75; 47 -2.25,3.75; 48 -2.75,3.75; 49 -3.25,3.75; 50 -3.75,3.75; 51 -4.25,3.75; 52 -4.75,3.75; 53 -5.25,3.75; 54 -5.75,3.75; 55 -6.25,3.75; 56 -6.75,3.75 | smd 7 x 3.61: EXP@1 -3.5,0; EXP@2 3.5,0
SOT-23 = smd 0.45 x 1.1: 1 0,-1.3; 2 0.65,-1.3; 3 1.3,-1.3; 4 1.95,-1.3; 5 1.95,1.3; 6 1.3,1.3; 7 0.65,1.3; 8 0,1.3
AS5134 = smd 0.46 x 1.43: 1 -1.105,-3.945; 2 -0.455,-3.945; 3 0.195,-3.945; 4 0.845,-3.945; 5 1.495,-3.945; 6 2.145,-3.945; 7 2.795,-3.945; 8 3.445,-3.945; 9 4.095,-3.945; 10 4.745,-3.945; 11 4.745,3.645; 12 4.095,3.645; 13 3.445,3.645; 14 2.795,3.645; 15 2.145,3.645; 16 1.495,3.645; 17 0.845,3.645; 18 0.195,3.645; 19 -0.455,3.645; 20 -1.105,3.645
DRC(S-PVSON-N10) = smd 0.28 x 0.85: 1 -2.27,-1.475; 2 -1.77,-1.475; 3 -1.27,-1.475; 4 -0.77,-1.475; 5 -0.27,-1.475; 6 -0.27,1.475; 7 -0.77,1.475; 8 -1.27,1.475; 9 -1.77,1.475; 10 -2.27,1.475 | smd 2.4 x 1.65: TH -1.27,0
SC70-6 = smd 0.35 x 0.8: 1 -0.65,-0.85; 2 0,-0.85; 3 0.65,-0.85; 4 0.65,0.85; 5 0,0.85; 6 -0.65,0.85
1X02 = drill 1.016 long: 1 -1.27,0; 2 1.27,0
MOLEX_503480-0600 = smd 0.3 x 1.15: 1 -1.25,1.725; 2 -0.75,1.725; 3 -0.25,1.725; 4 0.25,1.725; 5 0.75,1.725; 6 1.25,1.725 | smd 1.035 x 1: L -2.408,-1.15; R 2.408,-1.15
1X04 = drill 1.016 long: 1 -3.81,0; 2 -1.27,0; 3 1.27,0; 4 3.81,0
0805 = smd 0.8 x 1.2: 1 -0.9,0; 2 0.9,0
LED-0603 = smd 0.8 x 0.8: A 0,-0.75; C 0,0.75
FREESCALEKL05Z = drill 1 pad 1.676 octagon: 3.3V 5.08,-24.13; 5V 7.62,-24.13; 12C_SDA_PTB4_D14 -9.144,24.13; A0_PTB8 20.32,-24.13; A1_PTB9 22.86,-24.13; A2_PTA8 25.4,-24.13; A3_PTA0 27.94,-24.13; A4_PTA9 30.48,-24.13; A5_PTB13 33.02,-24.13; AVDD -6.604,24.13; GND -4.064,24.13; GND1 12.7,-24.13; GND2 10.16,-24.13; I2C_SCL_PTB3_D15 -11.684,24.13; IOREF 0,-24.13; MISO_PTA6_D12 1.016,24.13; MOSI_PTA_D11 3.556,24.13; PTA10_D4 22.86,24.13; PTA11_D2 27.94,24.13; PTA12_D5 20.32,24.13; PTA_D10 6.096,24.13; PTB5_D3 25.4,24.13; PTB6_D6 17.78,24.13; PTB7_D7 15.24,24.13; PTB10_D8 11.176,24.13; PTB11_D9 8.636,24.13; RESET 2.54,-24.13; RX_PTB1_D1 30.48,24.13; SCK_PTB0_D13 -1.524,24.13; SDA_PTDS -2.54,-24.13; TX_PTB2_D0 33.02,24.13; VIN 15.24,-24.13
MBED-KIT = drill 1.016: D+ 11.43,1.27; D- 11.43,3.81; GND -11.43,24.13; IF+ 11.43,16.51; IF- 11.43,19.05; NR -11.43,16.51; P$5 -11.43,13.97; P$6 -11.43,11.43; P$7 -11.43,8.89; P$8 -11.43,6.35; P$9 -11.43,3.81; P$10 -11.43,1.27; P$11 -11.43,-1.27; P$12 -11.43,-3.81; P$13 -11.43,-6.35; P$14 -11.43,-8.89; P$15 -11.43,-11.43; P$16 -11.43,-13.97; P$17 -11.43,-16.51; P$18 -11.43,-19.05; P$19 -11.43,-21.59; P$20 -11.43,-24.13; P$21 11.43,-24.13; P$22 11.43,-21.59; P$23 11.43,-19.05; P$24 11.43,-16.51; P$25 11.43,-13.97; P$26 11.43,-11.43; P$27 11.43,-8.89; P$28 11.43,-6.35; P$29 11.43,-3.81; P$30 11.43,-1.27; RD+ 11.43,11.43; RD- 11.43,13.97; TD+ 11.43,6.35; TD- 11.43,8.89; VB -11.43,19.05; VIN -11.43,21.59; VOUT 11.43,24.13; VU 11.43,21.59
S-1804MOTOR = hole 2.286: -12.497,12.497; 12.497,12.497; 12.497,-12.497; -12.497,-12.497
SMD1,27-2,54 = smd 1.27 x 2.54: 1 0,0
SOT23-3 = smd 0.8 x 0.9: 1 -0.95,-1; 2 0.95,-1; 3 0,1.1
TO252 = smd 1 x 1.6: 1 -2.28,-4.8; 2 2.28,-4.8 | smd 5.4 x 6.2: 3 0,2.5
SLPS388A = smd 0.75 x 0.675: 1 5.88,-4.173; 2 5.88,-2.877; 3 5.88,-1.657; 4 5.88,-0.348 | smd 0.665 x 0.675: 5 0.328,-0.338; 6 0.328,-1.657; 7 0.328,-2.877; 8 0.326,-4.173 | smd 4.295 x 4.51: PAD 2.805,-2.255
0402-RES = smd 0.508 x 0.711: 1 -0.483,0; 2 0.483,0
0603-RES = smd 0.94 x 1.016: 1 -0.749,0; 2 0.749,0
R2010 = smd 1.8 x 2.7: 1 -2.2,0; 2 2.2,0
TACTILE-PTH = drill 1.016 pad 1.88: 1 -3.251,2.261; 2 3.251,2.261; 3 -3.251,-2.261; 4 3.251,-2.261
JS202011SCQN = smd 1.2 x 2.5: 1 -2.5,-2.75; 2 0,-2.75; 3 2.5,-2.75; 4 2.5,2.75; 5 0,2.75; 6 -2.5,2.75
SJ_2 = smd 1.168 x 1.6: 1 -1.524,0; 2 0,0; 3 1.524,0
SJ = smd 1.168 x 1.6: 1 -0.762,0; 2 0.762,0

### Placement (x,y rotation side)
C1  42.52,33.32 0 bottom
C2  44.65,33.27 180 bottom
C3  43.03,39.93 270 bottom
C4  42.27,42.11 270 bottom
C5  41.1,45.06 90 bottom
C6  41.05,48.01 270 bottom
C7  34.49,33.02 270 bottom
C8  33.32,41.61 90 bottom
C9  31.5,39.32 90 bottom
C10  33.17,44.2 90 bottom
C11  35.61,36.42 90 bottom
C12  19.56,20.68 90 bottom
C13  15.39,22.15 180 bottom
C14  36.17,33.93 270 bottom
C15  33.17,34.29 90 bottom
C16  31.8,34.29 90 bottom
C17  16.1,53.75 90 bottom
C18  5.13,52.37 0 bottom
C19  12.14,60.81 90 bottom
C20  17.02,57 90 bottom
C21  5.23,40.34 0 bottom
C22  5.23,32.26 0 bottom
C23  29.41,42.11 270 top
C24  29.21,34.14 90 top
C25  29.62,51.26 270 top
C26  15.34,23.57 0 bottom
C27  17.63,23.47 90 bottom
C28  11.63,13.56 270 bottom
C29  18.08,72.39 90 bottom
C30  10.31,60.76 90 bottom
C31  20.93,62.69 270 bottom
C32  20.98,66.24 90 bottom
C37  21.74,59.44 90 bottom
D1  37.19,43.43 90 bottom
IC1  37.03,41.35 90 top
IC2  19.61,19.81 90 top
IC3  19.25,16.41 270 top
IC5  24.23,63.14 270 bottom
ICN  16.15,60.81 0 bottom
JP1  3,68.58 270 top
JP2  29.82,72.14 270 top
JP3  33.38,72.09 270 top
JP4  50.9,10.31 0 top
JP5  38.1,10.31 0 top
JP6  28.19,10.31 0 top
JP7  44.5,10.31 0 top
JP8  36.78,19.81 180 top
L1  37.08,37.29 270 bottom
LED1  37.03,25.45 180 top
LED2  34.34,25.35 180 top
LED3  39.27,25.4 180 top
LED4  31.65,24.74 180 top
LED5  32,55.78 180 top
M1  75.03,40.34 90 top
M2  75.23,40.28 180 top
MOTOR  [S-1804MOTOR]  19.25,16.41 0 top
PAD1  8.13,47.6 90 top
PAD2  7.06,38.91 90 top
PAD3  7.06,33.27 90 top
PAD4  7.21,66.5 90 top
PAD5  7.42,74.63 270 bottom
PAD9  7.11,17.17 270 top
Q1  40.84,28.8 270 top
Q2  36.42,28.8 270 top
Q3  12.6,69.6 180 bottom
Q4  16.15,53.59 270 top
Q5  16,43.64 270 top
Q6  15.85,33.83 270 top
Q7  18.44,47.29 90 top
Q8  18.75,36.98 90 top
Q9  18.75,27.43 90 top
R1  40.79,32.36 90 bottom
R2  43.69,35.15 0 bottom
R3  37.74,34.95 90 bottom
R4  39.12,35 90 bottom
R5  43.94,36.88 270 bottom
R6  38.61,38.05 270 bottom
R7  44.55,40.28 270 bottom
R8  37.74,31.55 90 bottom
R9  36.22,31.6 90 bottom
R10  36.93,25.35 270 bottom
R11  34.19,25.5 270 bottom
R12  18.69,56.95 90 bottom
R13  18.19,75.08 0 bottom
R14  31.45,24.74 270 bottom
R15  39.37,25.35 270 bottom
R16  26.87,51 90 top
R17  26.72,40.64 90 top
R18  26.62,31.14 90 top
R19  16.1,20.27 90 bottom
R20  14.68,20.37 270 bottom
R21  21.44,23.27 90 bottom
R22  23.22,20.07 270 bottom
R23  23.22,22.61 270 bottom
R24  19.41,23.47 270 bottom
R25  32,52.58 90 top
R26  19.56,69.75 270 bottom
R27  23.27,59.54 90 bottom
R28  25.35,59.59 270 bottom
R29  19.56,72.34 270 bottom
R30  7.26,59.94 270 bottom
R38  18.54,59.54 90 bottom
R39  20.17,59.44 270 bottom
S1  37.39,64.36 180 top
S2  37.34,54.1 90 top
SJ1  33.07,11.79 270 top
SJ2  43.74,17.22 0 top
SJ3  21.74,45.57 0 top
SJ4  42.98,51.1 270 top
SJ5  30.78,31.55 0 top
SJ6  43.79,14.17 0 top
SJ7  23.62,73.3 0 top
SJ8  24.64,69.8 180 top

### Tracks (layer width: path | path; a pad name or v marks a point on that pad's centre or on a via)
3.3V  (via drill 0.38)
  Top 0.152: IC1.49 33.98,38.1 34.59,37.49 v34.59,37.03 | v16.92,21.64 18.19,21.64 | 18.19,21.64 IC2.5 | 18.19,21.64 19.2,21.64 19.66,21.18 19.66,18.59 v19.66,10.06 | S2.5 34.59,54.25 | JP6.6 29.44,12.83 30.18,13.56
  Top 0.254: v35.51,26.21 35.51,26.06 | 34.59,54.25 37.19,56.84 37.19,59.44 37.64,59.89 43.43,59.89 | v19.05,18.44 19.51,18.44 19.66,18.59
  Top 0.406: v19.2,62.64 20.12,61.72 22.4,61.72 23.16,60.96 v26.98,60.96
  Bottom 0.152: R19.2 16.1,21.92 | 16.1,21.92 C13.2 15.88,23.52 C26.1 | 16.1,21.92 16.64,21.92 v16.92,21.64 | 19.66,19.72 C12.1 | 36.73,35.2 37.19,34.75 37.47,34.75 R3.1 36.73,33.45 C14.2 | 36.73,35.2 35.36,35.2 35.2,35.05 34.14,35.05 33.83,35.36 33.83,36.27 v34.59,37.03 | 36.73,35.2 36.73,36.03 L1.2
  Bottom 0.254: C31.1 21.41,63.91 IC5.7 21.55,63.91 21.03,63.4 | C14.2 36.17,32.13 R9.2 37.69,32.08 R8.2 37.67,32.03 37.03,31.39 37.03,27.74 v35.51,26.21 | C12.1 19.56,18.95 v19.05,18.44 | v19.66,10.06 16.46,10.06 v15.24,8.84
  Bottom 0.406: 21.03,63.4 19.96,63.4 v19.2,62.64 | v26.98,60.96 29.87,60.96 30.33,60.5 47.4,60.5 v47.85,60.96
  pour Top: 42.98,75.74 103.17,75.74 103.17,7.32 5.33,7.32 5.49,23.47 27.74,23.47 27.74,26.82 42.82,26.82
3.3V1
  Top 0.254: S2.4 32.08,56.6 LED5.A
5V  (via drill 0.38)
  Top 0.254: v39.32,13.26 39.32,12.07 JP5.6
  Top 0.406: v13.11,13.26 13.41,13.56 13.72,13.56 | 13.72,13.56 15.26,13.56 IC3.7 | v16,64.31 6.4,64.31 5.03,62.94 5.03,14.33 6.1,13.26 13.41,13.26 13.72,13.56
  Bottom 0.254: IC5.9 21.56,64.91 C32.1 | v39.32,13.26 21.64,13.26 18.9,10.52 12.5,10.52 11.58,11.43 11.58,13.03 C28.2
  Bottom 0.406: 11.61,13.11 C28.2 12.93,13.08 v13.11,13.26 | C32.1 17.18,65.49 v16,64.31
05Z_3.3V
  Top 0.254: S1.2 S1.1
  Bottom 0.152: M1.3.3V 99.06,45.41 96.62,47.85 96.62,63.4 91.44,68.58 53.19,68.58 52.12,69.65 41.3,69.65 39.01,67.36 39.01,63.73 S1.1
A_I  (via drill 0.38)
  Top 0.152: IC1.25 41.57,46.6 42.06,47.09 42.06,49.43 SJ4.2 43.64,50.34 v45.57,52.27 | M1.A2_PTA8 87.99,65.73 M2.P$20
  Bottom 0.152: v45.57,52.27 46.79,52.27 48.62,54.1 61.57,54.1 62.94,55.47 80.92,55.47 86.26,60.81 87.17,60.81 87.94,61.57 87.94,63.14 M2.P$20
ADC_REF  (via drill 0.38)
  Top 0.152: M1.AVDD 52.48,33.73 59.74,41 v59.74,41.45 | IC1.24 40.01,46.1 v39.62,46.48 | v49.23,46.33 49.23,46.18 50.29,45.11 59.13,45.11 v60.5,43.74
  Bottom 0.152: v39.62,46.48 39.47,46.48 39.01,46.94 39.01,49.23 39.93,50.14 41.3,50.14 41.76,49.68 41.76,49.23 43.43,47.55 48.01,47.55 v49.23,46.33 | v60.5,43.74 60.5,42.22 v59.74,41.45 | M2.VOUT 63.8,16.66 62.64,17.83 62.64,22 M1.AVDD
AVDD  (via drill 0.38)
  Top 0.152: v39.62,47.55 40.73,47.55 IC1.27
  Bottom 0.152: v39.62,47.55 41.02,47.55 C6.2
B_I  (via drill 0.38)
  Top 0.152: IC1.26 41.46,47.1 41.76,47.4 41.76,51.21 42.06,51.51 42.62,51.51 SJ4.1 43.33,51.87 v44.96,53.49 | M2.P$19 97.84,61.87 M1.A1_PTB9
  Bottom 0.152: v44.96,53.49 47.55,53.49 48.46,54.41 61.27,54.41 62.64,55.78 80.57,55.78 M2.P$19
BAT+
  pour Bottom: 5.64,68.12 26.97,68.12 26.97,76.05 5.64,76.05
BST_A  (via drill 0.38)
  Top 0.152: IC1.48 33.33,38.56 34.44,38.56 v34.59,38.41
  Bottom 0.152: C9.1 31.88,38.84 32.16,38.56 34.44,38.56 v34.59,38.41
BST_B  (via drill 0.38)
  Top 0.152: v34.59,41.15 33.33,41.15 IC1.43
  Bottom 0.152: C8.1 34.57,41.12 v34.59,41.15
BST_BK  (via drill 0.38)
  Top 0.152: 33.31,36.58 IC1.52 33.81,36.6 34.14,36.27 34.14,36.12 v34.59,35.66
  Bottom 0.152: v34.59,35.66 35.33,35.66 C11.1
BST_C  (via drill 0.38)
  Top 0.152: IC1.38 33.3,43.59 34.29,43.59 v34.59,43.89
  Bottom 0.152: C10.1 34.42,43.71 v34.59,43.89
C_I  (via drill 0.38)
  Top 0.152: v22.25,19.36 21.37,19.36 IC2.1 | M1.A0_PTB8 87.99,60.66 M2.P$18 88.09,57.91 88.09,23.62 87.17,22.71 v46.33,22.71
  Bottom 0.152: v22.25,19.36 22.48,19.58 R22.2 23.75,19.05 28.5,19.05 32.46,23.01 46.02,23.01 v46.33,22.71
CP1  (via drill 0.38)
  Top 0.152: v39.47,40.69 39.93,41.15 40.74,41.15 IC1.14
  Bottom 0.152: C4.2 40.41,41.63 v39.47,40.69
CP2  (via drill 0.38)
  Top 0.152: v39.47,41.6 IC1.15
  Bottom 0.152: C4.1 40.46,42.6 v39.47,41.6
CS_DRV  (via drill 0.38)
  Top 0.152: M2.P$8 84.78,33.93 77.57,41.15 v67.82,41.15 | v39.62,38.56 39.62,38.41 39.93,38.1 IC1.8
  Bottom 0.152: v67.82,41.15 66.6,39.93 64.47,39.93 64.31,40.08 63.09,40.08 62.79,40.39 52.27,40.39 51.82,39.93 47.24,39.93 45.41,38.1 40.08,38.1 v39.62,38.56
CS_EXT  (via drill 0.38)
  Top 0.152: JP4.5 51.65,12.79 51.97,13.11 v53.19,13.11
  Bottom 0.152: M1.PTA10_D4 83.77,63.2 86.41,65.84 87.33,65.84 88.7,64.47 88.7,53.75 M2.P$15 89.76,48.62 89.76,19.36 87.78,17.37 85.04,17.37 80.77,13.11 v53.19,13.11
DC_CAL  (via drill 0.38)
  Top 0.152: v41.91,39.62 41.45,40.08 40.8,40.08 IC1.12
  Bottom 0.152: R7.2 43.71,39.8 43.59,39.93 42.22,39.93 v41.91,39.62
DRV_CLK  (via drill 0.38)
  Top 0.152: IC1.11 39.75,39.6 v39.62,39.47 | v66.14,40.54 77.52,40.54 M2.P$7
  Bottom 0.152: v39.62,39.47 40.23,39.47 40.84,38.86 43.28,38.86 43.59,38.56 44.96,38.56 46.63,40.23 51.51,40.23 51.97,40.69 62.94,40.69 63.09,40.54 v66.14,40.54
DRV_MISO  (via drill 0.38)
  Top 0.152: JP4.4 51.21,12.09 51.21,12.8 46.79,17.22 SJ2.2 45.72,18.44 v45.72,18.59 | IC1.10 41.52,39.1 42.06,38.56 47.4,38.56 v47.55,38.41 | M2.P$6 65.89,28.85 64.77,27.74 54.25,27.74 51.97,30.02 50.29,30.02 49.99,30.33 49.07,30.33 48.16,29.41 v48.16,28.96
  Bottom 0.152: 45.87,18.75 v45.72,18.59 47.85,20.73 47.85,28.65 v48.16,28.96 47.85,29.26 47.85,36.73 47.55,37.03 v47.55,38.41
DRV_MOSI  (via drill 0.38)
  Top 0.152: JP4.2 50.14,12.65 48.62,14.17 SJ6.2 45.62,15.24 v46.33,15.24 | IC1.9 41.56,38.6 41.91,38.25 42.22,38.25 42.37,38.1 46.33,38.1 47.09,37.34 v48.16,37.34 | M2.P$5 65.43,26.31 64.31,27.43 54.1,27.43 51.82,29.72 v49.53,29.72
  Bottom 0.152: 46.63,15.54 v46.33,15.24 48.16,17.07 48.16,28.04 48.92,28.8 48.92,29.11 v49.53,29.72 49.53,32 48.92,32.61 48.92,33.53 48.16,34.29 v48.16,37.34
DTC  (via drill 0.38)
  Top 0.152: v39.62,37.49 39.78,37.64 40.74,37.64 IC1.7
  Bottom 0.152: R6.2 39.55,37.57 v39.62,37.49
DVDD  (via drill 0.38)
  Top 0.152: v39.62,45.57 40.75,45.57 IC1.23
  Bottom 0.152: C5.2 39.65,45.54 v39.62,45.57
EN_GATE  (via drill 0.38)
  Top 0.152: IC1.16 43.4,42.1 v43.74,41.76 | v39.01,52.88 39.01,53.03 S2.2
  Bottom 0.152: v43.74,41.76 43.74,42.52 42.82,43.43 39.62,43.43 38.71,44.35 38.71,52.58 v39.01,52.88
ENABLE  (via drill 0.38)
  Top 0.152: v40.08,55.32 S2.3
  Bottom 0.152: M2.P$27 61.47,51.51 M1.PTB10_D8 45.11,51.51 41.45,55.17 40.23,55.17 v40.08,55.32
ENC_CLK  (via drill 0.38)
  Top 0.152: v24.54,17.83 28.5,17.83 33.22,22.55 43.43,22.55 46.33,25.45 46.33,29.72 49.53,32.92 49.53,37.44 M1.SCK_PTB0_D13 | v13.72,11.73 13.72,11.89 14.17,12.34 15.28,12.34 IC3.9
  Bottom 0.152: v13.72,11.73 18.44,11.73 v24.54,17.83 | M1.SCK_PTB0_D13 62.23,38.81 63.09,37.95 83.21,37.95 85.5,40.23 87.78,40.23 88.54,41 88.54,44.76 M2.P$13
ENC_CS  (via drill 0.38)
  Top 0.152: IC3.4 16.14,15.56 16.92,14.78 16.92,11.12 18.59,9.45 24.08,9.45 25.3,10.67 29.26,10.67 30.33,11.73 30.33,12.34 32.77,14.78 v38.25,14.78 38.25,13.41 38.86,12.8 38.86,12.05 JP5.5 | M1.A5_PTB13 91.34,73.36 83.67,65.68 83.67,52.17 M2.P$14
  Bottom 0.152: M2.P$14 89,46.84 89,19.36 87.33,17.68 84.89,17.68 80.92,13.72 48.92,13.72 45.11,9.91 43.13,9.91 41.45,11.58 41.45,13.26 39.93,14.78 v38.25,14.78
ENC_DIO
  Top 0.152: IC3.10 18.13,8.84 24.08,8.84 25.45,10.21 29.87,10.21 31.55,11.89 32.97,11.89 SJ1.2
ENC_MISO  (via drill 0.38)
  Top 0.152: 38.41,12.09 38.41,12.65 37.74,13.31 SJ1.1 | 38.41,12.09 38.41,11.12 38.56,10.97 39.62,10.97 40.08,11.43 40.08,14.33 SJ2.1 42.98,18.14 v44.5,19.66 | v46.94,32.46 46.94,32.77 48.01,33.83 48.01,34.75 49.07,35.81 49.07,39.52 M1.MISO_PTA6_D12 | 38.41,12.09 JP5.4
  Bottom 0.152: v44.5,19.66 45.26,19.66 45.41,19.81 46.02,19.81 47.24,21.03 47.24,32.16 v46.94,32.46 | M1.MISO_PTA6_D12 56.59,41.35 59.74,44.5 61.27,44.5 62.94,42.82 83.52,42.82 85.8,40.54 87.48,40.54 88.24,41.3 88.24,42.52 M2.P$12
ENC_MOSI  (via drill 0.38)
  Top 0.152: SJ1.3 36.47,10.26 37.34,11.12 37.34,12.03 JP5.2 37.35,10.96 38.1,10.21 39.93,10.21 40.54,10.82 40.54,13.56 41.15,14.17 SJ6.1 43.03,15.14 43.43,15.54 45.57,15.54 v46.33,16.31 | v47.24,34.75 48.77,36.27 48.77,41.76 M1.MOSI_PTA_D11
  Bottom 0.152: v46.33,16.31 46.33,16.46 44.96,17.83 44.96,18.9 45.57,19.51 46.18,19.51 47.55,20.88 47.55,34.44 v47.24,34.75 | M1.MOSI_PTA_D11 58.37,43.89 59.59,45.11 83.11,45.11 M2.P$11
FAULT  (via drill 0.38)
  Top 0.152: v39.17,33.53 37.03,33.53 v34.44,30.94 34.44,30.33 34.9,29.87 35.31,29.87 Q2.1 | v41.91,37.49 41.45,37.03 40.85,37.03 IC1.6
  Bottom 0.152: v34.44,30.94 36.04,30.94 R9.1 | v41.91,37.49 40.08,35.66 40.08,34.44 v39.17,33.53
GH_A  (via drill 0.38)
  Top 0.152: Q4.4 16.75,47.71 v16.76,47.7 | v29.57,38.56 29.72,38.56 30.18,39.01 33.2,39.01 IC1.47
  Bottom 0.152: v16.76,47.7 22.71,47.7 23.62,46.79 24.38,46.79 24.69,47.09 27.13,47.09 27.58,46.63 27.58,39.17 28.19,38.56 v29.57,38.56
GH_B  (via drill 0.38)
  Top 0.152: IC1.42 32.3,41.6 31.24,40.54 28.8,40.54 28.35,41 25.15,41 v23.93,39.78 | v16.61,37.8 15.69,37.8 Q5.4
  Bottom 0.152: v23.93,39.78 23.47,39.32 18.14,39.32 v16.61,37.8
GH_C  (via drill 0.38)
  Top 0.152: Q6.4 16.37,27.95 v16.46,28.04 | v26.98,44.65 31.39,44.65 31.85,44.2 33.19,44.2 IC1.37
  Bottom 0.152: v16.46,28.04 25.6,28.04 26.36,28.8 26.36,44.04 v26.98,44.65
GL_A  (via drill 0.38)
  Top 0.152: Q7.4 18.79,54.3 v18.9,54.41 | v28.8,39.62 31.85,39.62 32.31,40.08 33.26,40.08 IC1.45
  Bottom 0.152: v28.8,39.62 28.19,40.23 28.19,47.55 27.58,48.16 19.2,48.16 18.9,48.46 v18.9,54.41
GL_B  (via drill 0.38)
  Top 0.152: Q8.4 19.09,43.48 19.66,44.04 30.94,44.04 v31.09,43.89 | v34.59,42.98 34.29,42.67 33.35,42.67 IC1.40
  Bottom 0.152: v34.59,42.98 35.2,43.59 35.2,44.2 34.9,44.5 34.29,44.5 34.14,44.35 33.83,44.35 33.68,44.2 31.39,44.2 v31.09,43.89
GL_C  (via drill 0.38)
  Top 0.152: Q9.4 19.09,33.72 v19.81,34.44 | v26.82,46.48 30.79,46.48 32.16,45.11 IC1.35
  Bottom 0.152: v19.81,34.44 24.84,34.44 25.76,35.36 25.76,45.57 26.67,46.48 v26.82,46.48
GND  (via drill 0.38)
  Top 0.152: IC2.4 20.91,22.37 20.42,22.86 v20.42,23.01 | IC3.5 15.18,14.78 v12.5,14.78 14.58,16.86 IC3.2 | v36.12,11.58 36.57,12.04 JP5.1 36.88,12.07 36.88,12.65 37.19,12.95 37.64,12.95 37.85,12.75 JP5.3 | 44.2,11.98 JP7.3 | 45.26,12.03 JP7.5 45.26,12.05 45.26,12.65 44.96,12.95 44.35,12.95 44.25,12.86 JP7.3 | JP6.3 27.89,11.98 27.89,11.43 27.58,11.12 27.28,11.12 26.94,11.46 JP6.1 26.52,12.04 v26.21,12.04 | JP4.3 50.65,11.33 50.44,11.12 49.99,11.12 49.68,11.43 49.68,12.01 JP4.1 v48.92,12.04 | JP7.3 44.2,12.09 44.2,12.8 44.04,12.95 43.59,12.95 43.25,12.62 JP7.1 v42.52,12.04 | IC1.28 40.78,49.32 v41,49.53
  Top 0.254: 12.8,20.42 v12.8,20.88 12.8,19.66 14.33,18.14 16.76,18.14 16.76,17.22 16.41,16.86 14.58,16.86
  Bottom 0.152: R20.1 14.68,21.92 C13.1 14.91,23.52 C26.2 14.86,23.85 | C27.2 17.96,23.95 18.9,23.01 19.53,23.01 19.51,22.99 R24.2 19.53,22.86 20.27,22.86 v20.42,23.01 | C28.1 11.76,14.05 v12.5,14.78 | v41,49.53 41,48.54 C6.1 | C3.2 43.31,39.45 43.89,38.86 44.81,38.86 45.41,39.47 45.41,40.23 45.26,40.39 44.93,40.39 R7.1 | R15.1 39.37,26.11 v41.15,27.89 | R4.2 39.04,35.48 37.95,36.58 37.95,38.41 38.1,38.56 38.58,38.56 R6.1
  Bottom 0.254: v19.36,73.61 19.56,73.41 R29.1 18.14,72.82 C29.2 18.09,74.23 R13.1 | IC5.TH 24.33,64.41 24.84,64.92 25.7,64.92 IC5.2 | v23.77,61.87 23.77,60.53 R27.2 21.84,60.02 C37.2 R39.1 | C20.2 16.15,57.48 | 16.15,57.48 15.88,57.48 v15.09,56.69 | 16,59.44 16,57.63 16.15,57.48 | C30.2 10.53,61.29 C19.2 12.47,60.96 13.11,60.96 15.09,58.98 15.54,58.98 16,59.44 | R20.1 12.83,20.85 v12.8,20.88 | ICN.1 ICN.2 16,59.8 16,59.44
  Bottom 0.406: 23.77,62.79 23.77,63.96 IC5.TH | 23.71,61.94 v23.77,61.87 | C17.2 16.1,55.68 v15.09,56.69 | v19.66,66.6 20.59,66.6 C32.2
  other vias: 30.94,41.3
  pour Bottom: 27.89,75.59 103.17,75.74 103.17,7.32 1.07,7.32 1.07,75.9 4.72,75.9 4.72,24.99 27.89,24.99 27.74,38.4 27.74,60.96 18.44,60.96 18.44,67.21 27.89,67.21
  pour Top: 42.21,27.43 24.99,27.43 24.99,55.47 1.07,55.47 1.07,75.9 42.21,76.05
GVDD  (via drill 0.38)
  Top 0.152: v41.91,40.54 40.85,40.54 IC1.13
  Bottom 0.152: C3.1 42.04,40.41 v41.91,40.54
I_BATT  (via drill 0.38)
  Top 0.406: v13.41,62.79 9.75,62.79 v9.14,63.4
  Bottom 0.254: R26.2 14.77,69.27 Q3.3
  Bottom 0.406: 15.24,62.79 v13.41,62.79 | v9.14,63.4 8.52,63.4 R30.1
  pour Bottom: 5.64,61.11 17.68,61.11 17.68,67.21 5.64,67.21
N$1  (via drill 0.38)
  Top 0.152: v42.22,35.05 40.83,35.05 IC1.2
  Bottom 0.152: C1.1 43.2,33.53 R2.2 42.32,35.15 v42.22,35.05
N$2
  Bottom 0.152: R2.1 C2.1
N$3  (via drill 0.38)
  Top 0.254: v38.1,24.69 37.05,24.69 LED1.C
  Bottom 0.254: R10.2 38.01,24.6 v38.1,24.69
N$4  (via drill 0.38)
  Top 0.254: LED2.C 35.29,24.6 v35.36,24.54
  Bottom 0.254: v35.36,24.54 34.4,24.54 R11.2
N$5  (via drill 0.38)
  Top 0.152: Q1.2 38.67,27.85 38.1,27.28 v38.1,26.06
  Bottom 0.152: v38.1,26.06 36.97,26.06 R10.1
N$6  (via drill 0.38)
  Top 0.152: Q2.2 33.95,27.85 v32.77,26.67
  Bottom 0.152: v32.77,26.67 33.77,26.67 R11.1
N$7
  Bottom 0.254: C20.1 18.64,56.52 R12.1
N$8  (via drill 0.38)
  Top 0.254: v40.54,24.69 39.31,24.69 LED3.C
  Bottom 0.254: R15.2 40.45,24.6 v40.54,24.69
N$9
  Bottom 0.61: Q3.1 11.82,75.89 16.62,75.89 R13.2
N$10  (via drill 0.38)
  Top 0.152: LED4.C 31.76,23.99 v32.77,24.99
  Bottom 0.152: R14.2 31.76,23.99 v32.77,24.99
N$11
  Top 0.406: SJ7.3 27.38,73.3 JP2.2
N$12  (via drill 0.38)
  Top 0.152: v16.76,19.05 17.55,19.05 IC2.8
  Bottom 0.152: R20.2 14.78,19.79 R19.1 16.1,19.71 v16.76,19.05
N$13
  Top 0.406: JP3.2 31.75,69.19 29.11,69.19 27.13,71.17 24.08,71.17 23.32,70.41 23.32,70 SJ8.3
N$14  (via drill 0.38)
  Top 0.152: IC2.6 IC2.7 18.27,20.42 17.53,20.42 v17.22,20.12
  Bottom 0.152: C27.1 18.16,22.99 18.75,22.4 | 18.75,22.4 21.06,22.4 R21.1 | v17.22,20.12 17.22,20.88 18.75,22.4
N$15  (via drill 0.38)
  Top 0.152: IC2.3 21.87,21.11 v22.1,21.34
  Bottom 0.152: R24.1 21.23,23.95 R21.2 22.1,23.09 v22.1,21.34
N$16  (via drill 0.38)
  Top 0.152: v22.25,20.42 20.95,20.42 IC2.2
  Bottom 0.152: R23.2 R22.1 22.38,20.55 v22.25,20.42
N$17
  Top 0.152: IC3.1 7.46,17.51 PAD9.1
N$18
  Bottom 0.254: R38.2 18.44,60.02 ICN.6
N$19
  Top 0.254: LED5.C R25.2
OCTW  (via drill 0.38)
  Top 0.152: IC1.5 41.63,36.6 41.91,36.88 42.67,36.88 v42.82,37.03 | v39.01,30.79 39.01,30.58 Q1.1
  Bottom 0.152: R8.1 38.02,30.79 v39.01,30.79 40.08,31.85 40.08,33.98 40.54,34.44 41,34.44 41.45,34.9 41.45,36.42 41.91,36.88 42.67,36.88 v42.82,37.03
PH  (via drill 0.38)
  Top 0.152: 33.22,37.03 IC1.51 IC1.50 33.17,37.49 v32.16,37.49
  Bottom 0.152: C11.2 35.43,36.73 35.43,37.57 35.2,37.8 34.29,37.8 34.14,37.95 32.61,37.95 v32.16,37.49 | 35.59,36.88 C11.2 | C11.2 35.8,36.91 L1.1
  Bottom 0.254: D1.C 37.34,41.08 37.34,38.44 L1.1
PWM_AH
  Top 0.152: IC1.17 46.26,42.6 48.46,44.81 48.46,50.75 50.29,52.58 53.95,52.58 55.17,53.8 55.17,61.47 M1.PTB5_D3 52.22,64.41
  Bottom 0.152: M2.P$21 52.22,64.41 M1.PTB5_D3
PWM_AL
  Top 0.152: IC1.18 46.3,43.1 48.16,44.96 48.16,50.9 50.14,52.88 53.8,52.88 54.86,53.95 54.86,56.69 M1.PTA12_D5
  Bottom 0.152: M2.P$22 52.12,61.87 M1.PTA12_D5
PWM_BH
  Top 0.152: IC1.19 46.34,43.6 47.85,45.11 47.85,51.05 49.99,53.19 53.65,53.19 54.56,54.1 54.56,54.46 M1.PTB6_D6
  Bottom 0.152: M2.P$23 52.12,59.33 M1.PTB6_D6
PWM_BL
  Top 0.152: IC1.20 46.39,44.1 47.55,45.26 47.55,51.21 49.84,53.49 49.84,54.51 M1.PTB7_D7
  Bottom 0.152: M2.P$24 52.12,56.79 M1.PTB7_D7
PWM_CH  (via drill 0.38)
  Top 0.152: IC1.21 44.91,44.6 v45.11,44.81
  Bottom 0.152: M2.P$25 63.8,53.24 65.23,51.82 65.23,48.46 64.62,47.85 52.02,47.85 M1.PTB11_D9 51.97,47.9 51.97,45.72 51.51,45.26 46.02,45.26 45.57,44.81 v45.11,44.81
PWM_CL  (via drill 0.38)
  Top 0.152: IC1.22 43.58,45.1 v44.04,45.57
  Bottom 0.152: v44.04,45.57 50.04,45.57 M1.PTA_D10 49.68,47.65 49.68,49.38 50.44,50.14 51.82,50.14 53.8,48.16 64.31,48.16 64.92,48.77 64.92,49.53 63.8,50.65 M2.P$26
PWR_ENABLE1
  Bottom 0.254: R27.1 25.3,59.05 R28.2 25.17,59.11 24.69,59.59 24.69,61.72 25.6,62.64 25.6,63.31 IC5.5 IC5.4
PWRGD  (via drill 0.38)
  Top 0.152: v42.22,36.12 40.8,36.12 IC1.4
  Bottom 0.152: R5.2 42.49,36.4 v42.22,36.12
RST_05Z
  Top 0.254: S1.4 S1.3
  Bottom 0.152: M1.RESET 99.16,43.48 96.01,46.63 96.01,63.4 91.29,68.12 53.03,68.12 51.82,69.34 43.36,69.34 S1.3
RT_CLK  (via drill 0.38)
  Top 0.152: v40.69,33.68 40.69,34.51 IC1.1
  Bottom 0.152: R1.2 40.79,33.58 v40.69,33.68
SCL  (via drill 0.38)
  Top 0.152: JP7.4 44.75,10.88 v44.81,10.82
  Bottom 0.152: 44.96,10.82 v44.81,10.82 48.77,14.78 48.77,27.43 49.99,28.65 M1.I2C_SCL_PTB3_D15 52.43,30.18 52.43,31.39 51.51,32.31 50.44,32.31 49.84,32.92 49.84,34.29 50.44,34.9 51.51,34.9 53.65,32.77 64.62,32.77 67.06,35.2 87.17,35.2 87.94,35.97 87.94,36.73 86.67,38 M2.P$10
SDA  (via drill 0.38)
  Top 0.152: JP7.2 43.75,10.83 v43.74,10.82
  Bottom 0.152: 43.89,10.82 v43.74,10.82 48.46,15.54 48.46,27.74 50.9,30.18 M1.12C_SDA_PTB4_D14 | M2.P$9 65.89,36.47 64.62,35.2 50.29,35.2 49.53,34.44 49.53,32.56 M1.12C_SDA_PTB4_D14 | 50.95,31.24 M1.12C_SDA_PTB4_D14
SENSE_I_BATT  (via drill 0.38)
  Top 0.152: v22.55,57.91 28.8,57.91 v28.96,58.06 | M2.P$16 86.67,55.12 87.78,56.24 87.78,57.3 87.02,58.06 86.41,58.06 85.19,59.28 85.19,59.74 85.95,60.5 | 85.95,60.5 86.11,60.66 87.48,60.66 87.94,61.11 97.84,61.11 98.6,61.87 99.67,61.87 100.43,62.64 100.43,67 M1.A3_PTA0 | v84.89,61.42 85.04,61.42 85.95,60.5
  Bottom 0.152: C37.1 21.74,58.73 v22.55,57.91 | v28.96,58.06 49.38,58.06 50.44,57 51.66,57 52.58,57.91 81.38,57.91 v84.89,61.42
  Bottom 0.254: 20.12,58.9 R39.2 | R39.2 C37.1 | R38.1 20.07,59.05 R39.2
SENSE_V_BATT
  Top 0.152: M1.A4_PTA9 90.02,70.81 84.28,65.08 84.28,59.18 M2.P$17
  Bottom 0.152: M1.A4_PTA9 102.11,73.76 102.11,75.59 101.5,76.2 28.04,76.2 22.07,70.23 R26.1
  Bottom 0.254: C29.1 19.56,71.91 R29.2 R26.1
SH_A  (via drill 0.38)
  Top 0.152: IC1.46 33.31,39.62 34.29,39.62 v34.59,39.32 | Q7.8 23.7,47.62 v23.77,47.55
  Bottom 0.152: C9.2 32.13,39.8 32.61,39.32 v34.59,39.32 | v23.77,47.55 27.58,47.55 27.89,47.24 27.89,39.32 28.35,38.86 28.96,38.86 30.02,39.93 31.37,39.93 C9.2 | 31.47,39.78 C9.2
  pour Top: 5.64,44.96 24.38,44.96 24.38,55.02 5.64,55.02
SH_B  (via drill 0.38)
  Top 0.152: v34.59,42.06 33.32,42.06 IC1.41 33.24,42.06 28.65,42.06 28.19,41.6 22.86,41.6 21.95,40.69 21.9,40.69 21.7,40.48 | Q8.8 22.92,39.53 22.65,39.53 21.7,40.48 | 21.7,40.48 Q8.PAD
  Bottom 0.152: C8.2 34.57,42.09 v34.59,42.06
  pour Top: 24.38,44.35 5.64,44.35 5.64,34.59 24.38,34.59
SH_C  (via drill 0.38)
  Top 0.152: 33.34,44.65 IC1.36 33.21,44.68 | 33.21,44.68 31.98,44.68 31.09,45.57 v26.67,45.57 | v24.69,30.63 21.4,30.63 Q9.PAD | 33.21,44.68 34.01,44.68 v34.44,45.11
  Bottom 0.152: v26.67,45.57 26.06,44.96 26.06,32 v24.69,30.63 | C10.2 34.01,44.68 v34.44,45.11
  pour Top: 5.64,34.14 24.38,34.14 24.38,25.45 5.64,25.45
SL_A  (via drill 0.38)
  Top 0.152: C25.1 27.16,52.01 25.15,49.99 25.15,47.55 | 25.15,47.55 25.3,47.4 31.09,47.4 32.31,46.18 33.21,46.18 IC1.33 33.36,46.02 v34.59,46.02 | 25.15,47.55 23.16,45.57 SJ3.2 | SJ5.2 31.39,31.7 31.39,32.92 30.18,34.14 28.65,34.14 28.19,34.59 27.43,34.59 24.99,37.03 24.99,39.78 25.45,40.23 31.7,40.23 32,40.54 33.22,40.54 IC1.44 34.23,40.6 v34.59,40.23
  Top 0.254: C25.1 28.07,52.01 R16.2
  Top 1.27: Q7.3 Q7.2 Q7.1 26.84,53.17 R16.2
  Bottom 0.152: v34.59,40.23 34.9,40.23 35.2,40.54 35.2,42.37 35.51,42.67 35.51,43.13 35.81,43.43 35.81,44.04 35.36,44.5 35.36,45.26 v34.59,46.02
SL_B  (via drill 0.38)
  Top 0.152: IC1.39 31.24,43.1 30.79,42.64 v30.79,42.67 30.36,43.1 29.65,43.1 C23.1 | SJ3.1 20.42,45.57 18.29,43.43 18.29,42.37 18.44,42.22 19.75,42.22 Q8.3 | IC1.31 32.3,47.1 v32.16,47.24
  Top 0.254: C23.1 26.74,42.86 R17.2
  Top 1.27: Q8.3 Q8.2 Q8.1 26.7,42.86 R17.2
  Bottom 0.152: v32.16,47.24 32.16,46.18 30.33,44.35 30.33,43.13 v30.79,42.67
SL_C  (via drill 0.38)
  Top 0.152: Q9.1 22.92,33.59 v24.69,35.36 | v25.45,46.18 26.36,47.09 30.79,47.09 32.31,45.57 33.25,45.57 IC1.34 | SJ5.1 29.21,32.36 C24.1 29.16,33.34 29.03,33.34 | Q9.1 25.45,30.79 25.45,30.48 24.54,29.57 24.54,24.69 v23.93,24.08
  Top 0.254: R18.2 29.03,33.34
  Top 1.27: Q9.3 Q9.2 Q9.1 26.59,33.31 R18.2
  Bottom 0.152: v24.69,35.36 25.45,36.12 v25.45,46.18 | v23.93,24.08 23.93,23.8 R23.1
SS_TR  (via drill 0.38)
  Top 0.152: v34.44,34.44 34.29,34.59 IC1.56
  Bottom 0.152: v34.44,34.44 34.44,33.55 C7.1
U
  Top 0.152: IC3.11 24.16,11.66 24.69,12.19 24.69,14.02 25.15,14.48 29.26,14.48 | JP6.5 28.94,14.16 29.26,14.48 | 29.26,14.48 30.94,14.48 34.29,17.83 36.07,17.83 JP8.2 38.05,19.91 39.78,21.64 44.04,21.64 47.24,24.84 47.24,29.16 50.39,32.31 52.73,32.31 62.03,41.6 63.75,41.6 M2.P$30 67.06,44.81 67.06,64.47 58.17,73.36 M1.TX_PTB2_D0
V
  Top 0.152: JP6.4 28.44,13.47 28.19,13.72 25.6,13.72 25.3,13.41 25.3,12.19 24.23,11.12 21.79,11.12 21.64,11.28 21.64,12.04 21.79,12.19 22.78,12.19 IC3.12 23.9,12.31 24.38,12.8 24.38,14.17 24.99,14.78 30.48,14.78 JP8.3 37.64,21.95 43.89,21.95 46.94,24.99 46.94,29.41 50.14,32.61 51.82,32.61 63.25,44.04 63.75,44.04 M2.P$29 | M1.RX_PTB1_D1 60.25,70.81 66.6,64.47 66.6,46.89 M2.P$29 | M2.P$29 63.6,44.09
V3IN1  (via drill 0.38)
  Top 0.406: SJ8.2 24.64,65.02 v22.25,62.64
  Bottom 0.406: v22.25,62.64 22.25,62.91 IC5.6
V5IN1  (via drill 0.38)
  Top 0.406: 23.47,73.76 23.47,73.46 | 23.47,73.46 SJ7.2 | 23.47,73.46 23.47,71.78 23.32,71.63 21.95,71.63 21.34,71.02 21.34,68.73 22.66,67.41 v23.57,67.41
  Bottom 0.406: IC5.10 22.76,66.59 v23.57,67.41
V_BATT  (via drill 0.38)
  Top 0.152: v32.16,35.66 33.22,35.66 IC1.54 IC1.53 | IC1.29 30.23,48.1 v29.87,48.46 | v26.06,26.06 31.08,26.06 LED4.A
  Top 0.254: M1.VIN 99.42,55.58 100.74,54.25 100.74,32.77 M2.VIN 66.04,18.69 64.92,19.81 48.16,19.81 v46.33,21.64
  Top 0.406: v13.87,50.75 Q4.PAD 14.48,51.37 14.48,52.27 | v14.94,51.82 14.94,52.12 14.48,52.58 | 14.48,52.58 14.48,53.25 Q4.6 | Q4.5 15.82,52.7 v14.94,51.82 | 14.48,52.58 14.48,52.27 | 14.48,52.27 v14.94,51.82 | v14.94,51.82 v12.8,51.82 | Q4.8 11.98,52.64 v12.8,51.82 | Q4.7 13.28,52.29 v12.8,51.82 | Q5.5 15.7,43.28 15.7,42.67 15.09,42.06 v14.78,42.06 14.35,42.5 Q5.6 | Q5.7 13.12,42.54 v12.65,42.06 12.34,42.06 12.04,42.37 11.89,42.37 11.89,43.25 Q5.8 | v13.72,41 13.72,40.86 Q5.PAD | v13.56,31.09 13.56,31.06 Q6.PAD | v14.63,32.16 14.63,32.31 14.17,32.77 14.17,33.49 Q6.6 14.19,32.59 14.33,32.46 15.24,32.46 15.39,32.61 15.39,33.39 Q6.5 | Q6.8 11.68,32.98 v12.5,32.16 12.97,32.63 Q6.7
  Bottom 0.152: C16.2 31.8,35.31 v32.16,35.66 | C16.2 31.27,34.77 30.63,34.14 27.74,34.14 26.82,33.22 26.82,26.82 v26.06,26.06 | v29.87,48.46 26.06,48.46 25.76,48.77 | C15.2 C16.2
  Bottom 0.254: 16.46,63.55 16.61,63.4 16.15,62.94 ICN.5 16.15,61.27 15.54,60.66 15.54,60 ICN.3 | C30.1 11.82,60.01 C19.1 | v46.33,21.64 45.41,22.55 32.61,22.55 28.65,18.59 26.36,18.59 18.75,10.97 13.41,10.97 12.95,11.43 12.95,12.04 13.87,12.95 13.87,14.48 11.43,16.92 11.43,26.67
  Bottom 0.406: IC5.8 19.91,64.41 19.05,63.55 16.46,63.55 12.8,63.55 12.19,62.94 9.91,62.94 8.99,62.03 8.99,60.12 9.11,60.01 | C30.1 9.11,60.01 | 9.11,60.01 7.47,58.37 7.47,57.95 R30.2
  other vias: 14.94,49.68 12.8,49.68 14.78,39.93 12.65,39.93 14.63,30.02 12.5,30.02
  pour Bottom: 5.64,60.35 26.67,60.35 26.82,25.6 5.49,25.6
VSENSE  (via drill 0.38)
  Top 0.152: v39.62,36.42 39.62,35.97 39.93,35.66 40.72,35.66 IC1.3
  Bottom 0.152: R3.2 38.2,35.43 R4.1 39.4,34.52 39.78,34.9 39.78,36.27 v39.62,36.42
W
  Top 0.152: JP6.2 27.44,12.64 27.13,12.95 25.91,12.95 25.6,12.65 25.6,12.04 24.23,10.67 21.49,10.67 21.18,10.97 21.18,12.34 21.79,12.95 22.89,12.95 IC3.13 23.78,12.96 24.08,13.26 24.08,14.33 24.84,15.09 28.25,15.09 JP8.4 32.97,21.39 33.83,22.25 43.74,22.25 46.63,25.15 46.63,29.57 49.84,32.77 49.84,34.29 50.44,34.9 52.27,34.9 59.74,42.37 60.66,42.37 63.8,45.52 M2.P$28 66.14,48.97 66.14,64.31 62.18,68.28 M1.PTA11_D2

### Text on the board
tValues: MOTOR_ENABLED | FAULT | OCTW | 3.3V | V_BATT | W V U GND | SPI Drv & Enc Tie-in | G W G V U 3.3 | G E_MOSI G / E_MISO E_CS 5 | G SDA G / SCL G 3.3 | G D_MOSI G / D_MISO EXT_CS 3.3
bValues: Douglas Hutchings / Biomimetic Milisystems Labaratory / 2014.9.28 / Brushless DC Motor Controller / Rev. A